# Altium project vme6U_carrier_Cyc_V_SoC.PrjPcb (part 5 of 8)

## Sheet RFCtl.SchDoc
size 420 x 297 mm; Address1: Address1; Address2: Address2; Address3: Address3; Address4: Address4; SheetNumber: 1; Scale: 1:1; Разраб.: Иванов; Обозначение документа: АБВГ.123456.001 Э3; Пров.: Петров; Утв.: Сидоров; Наименование организации: ОАО "Концерн "МПО-Гидроприбор"; Перв. применение: АБВГ.123456.000; Наименование изделия 1: Плата; Наименование изделия 2: Схема электрическая; Наименование изделия 3: принципиальная; Нач. отд.: Нач. отд.; Фамилия нач. отд.: Сидоров
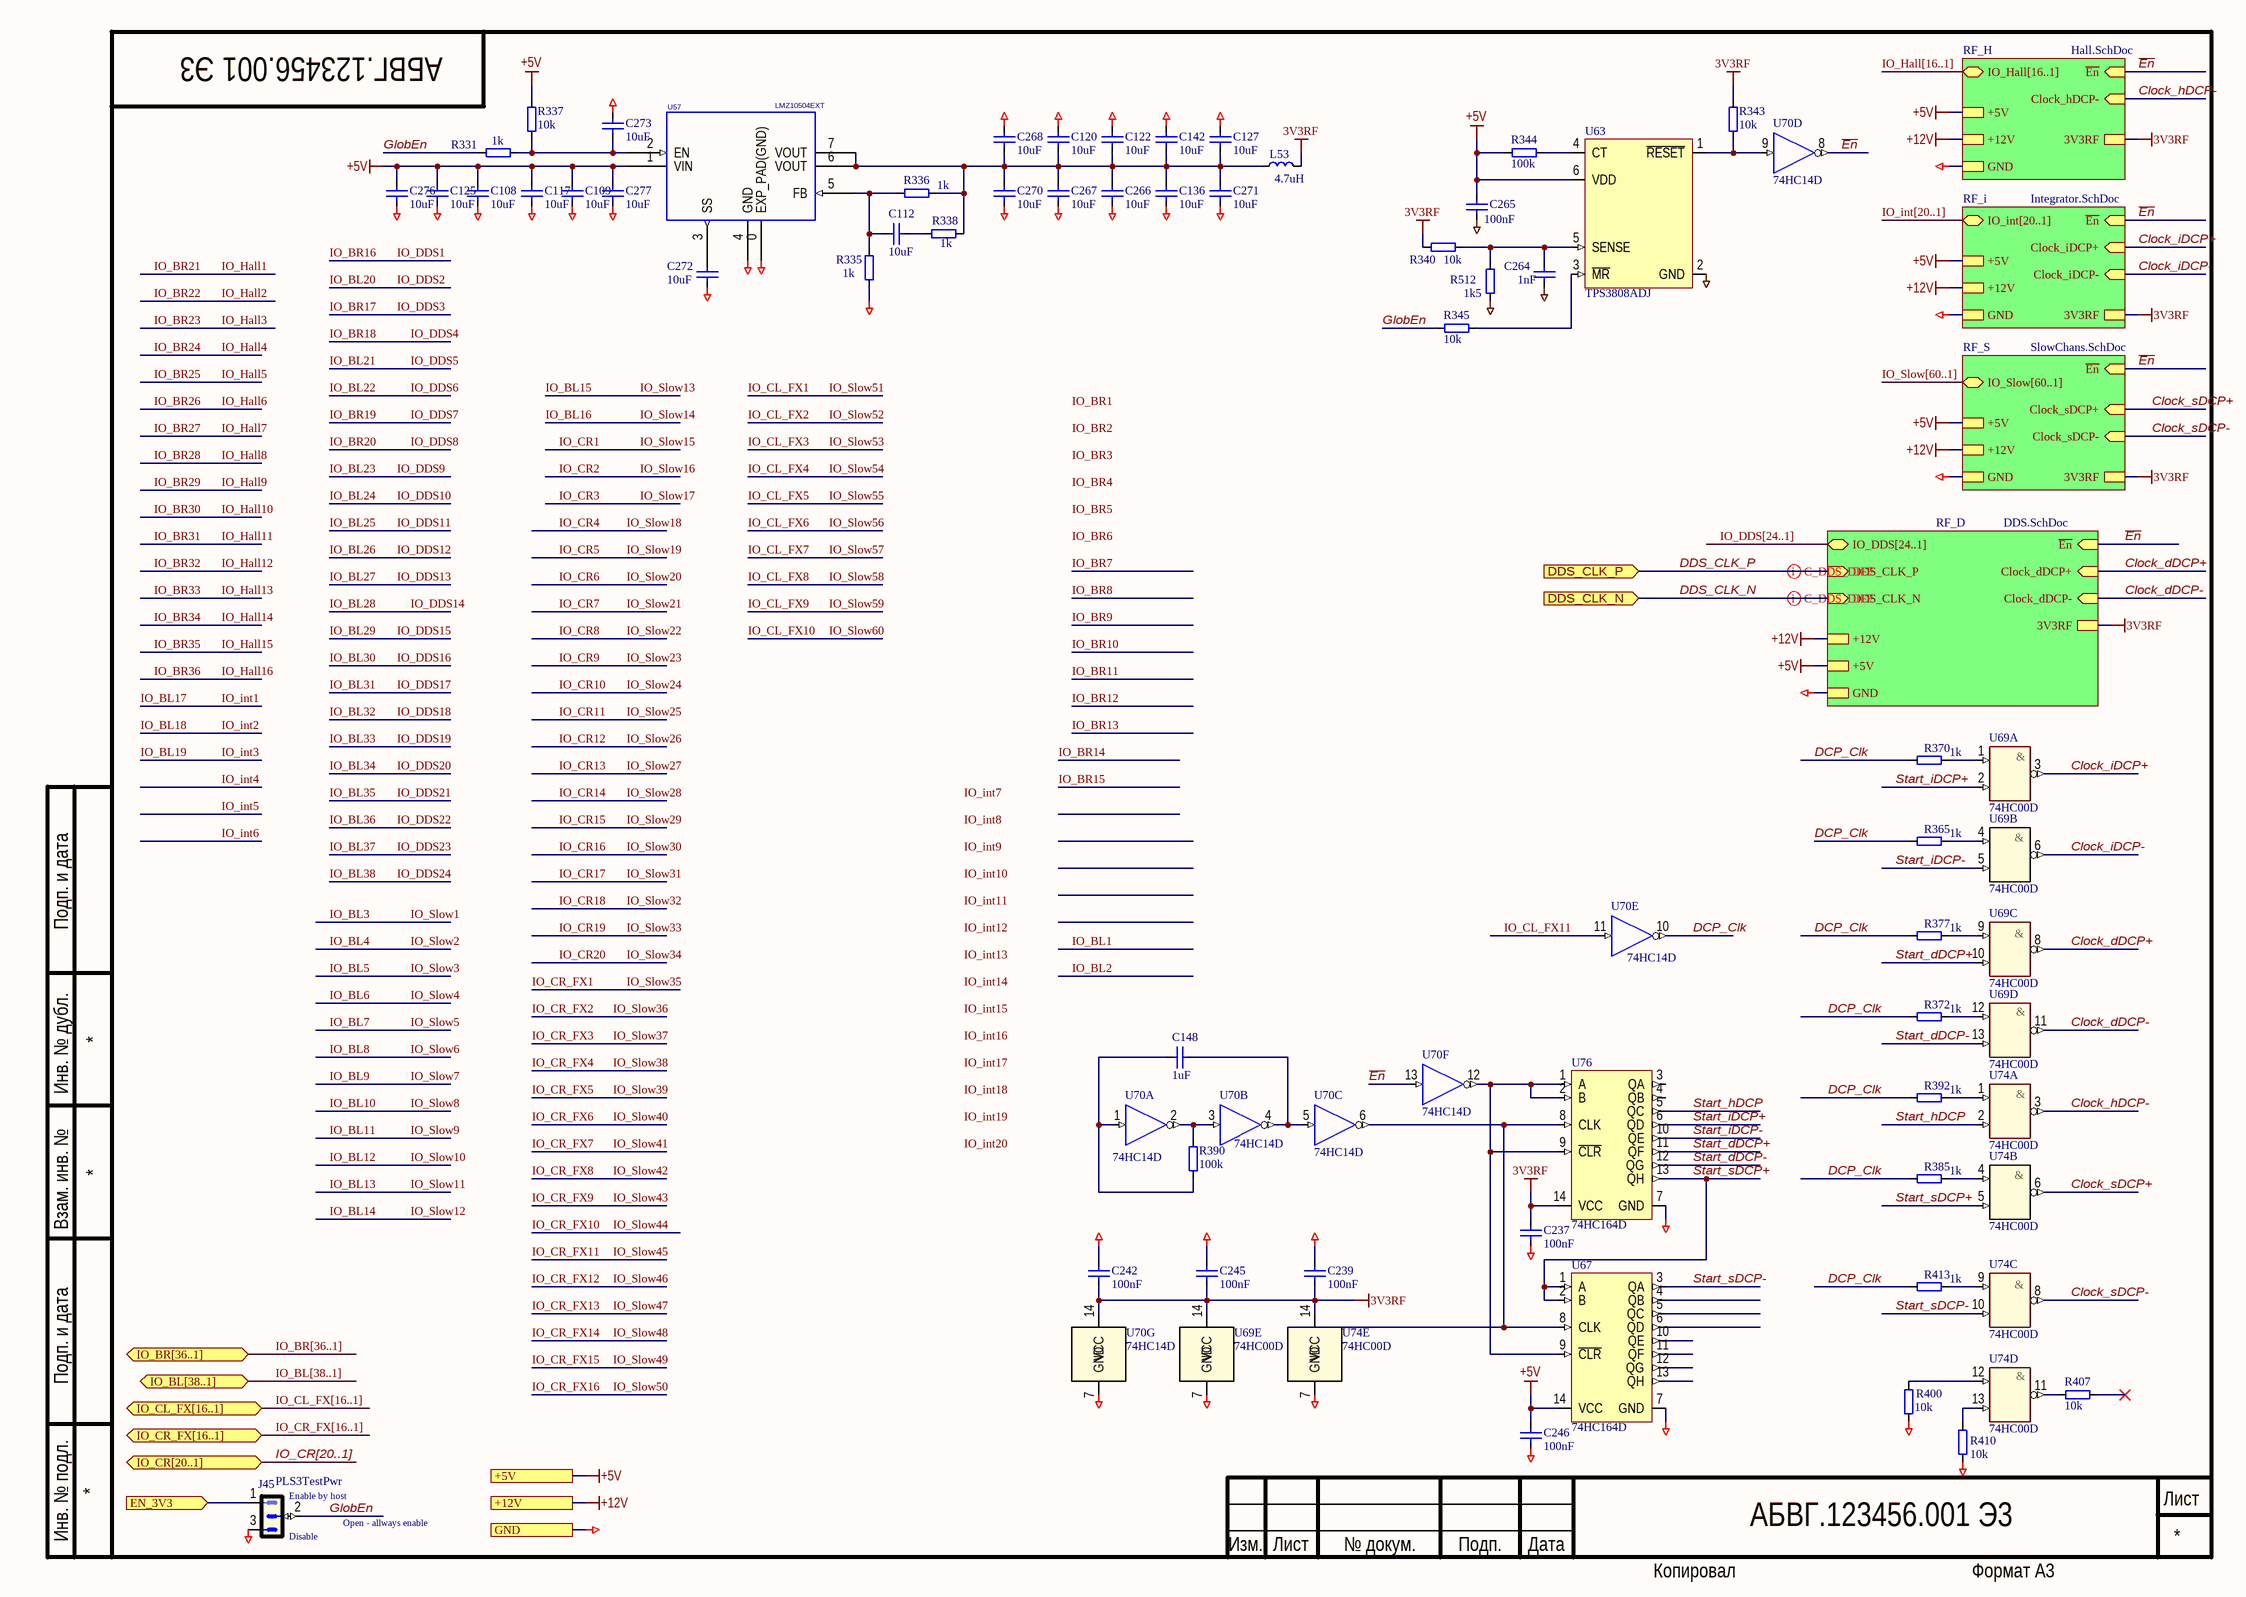
[diagram p15: RFCtl.SchDoc]

### Parts
(Parts that share a designator on the sheet are numbered #1, #2 ... from top to bottom, then left to right.)
C108  10uF  [SMD0805CAP]
C109  10uF  [SMD0805CAP]
C112#2  10uF  [SMD0805CAP]
C117#2  10uF  [SMD0805CAP]
C120#2  10uF  [SMD0805CAP]
C122#2  10uF  [SMD0805CAP]
C125#2  10uF  [SMD0805CAP]
C127#2  10uF  [SMD0805CAP]
C136  10uF  [SMD0805CAP]
C142#2  10uF  [SMD0805CAP]
C148#2  1uF  [SMD0805CAP]
C237  100nF  [SMD0805CAP]
C239  100nF  [SMD0805CAP]
C242  100nF  [SMD0805CAP]
C245  100nF  [SMD0805CAP]
C246  100nF  [SMD0805CAP]
C264  1nF  [SMD0805CAP]
C265  100nF  [SMD0805CAP]
C266  10uF  [SMD0805CAP]
C267  10uF  [SMD0805CAP]
C268  10uF  [SMD0805CAP]
C270  10uF  [SMD0805CAP]
C271  10uF  [SMD0805CAP]
C272  10uF  [SMD0805CAP]
C273  10uF  [SMD0805CAP]
C276  10uF  [SMD0805CAP]
C277  10uF  [SMD0805CAP]
J45  PLS3TestPwr  [PLS3]
L53  value 4.7uH  [IND_3225_MURATA_LQH_N]  (hidden comment: LQH32PN4R7NN0L)
R331  1k  [SMD0805RES]
R335  1k  [SMD0805RES]
R336  1k  [SMD0805RES]
R337  10k  [SMD0805RES]
R338  1k  [SMD0805RES]
R340  10k  [SMD0805RES]
R343  10k  [SMD0805RES]
R344  100k  [SMD0805RES]
R345  10k  [SMD0805RES]
R365  1k  [SMD0805RES]
R370  1k  [SMD0805RES]
R372  1k  [SMD0805RES]
R377  1k  [SMD0805RES]
R385  1k  [SMD0805RES]
R390  100k  [SMD0805RES]
R392  1k  [SMD0805RES]
R400  10k  [SMD0805RES]
R407  10k  [SMD0805RES]
R410  10k  [SMD0805RES]
R413  1k  [SMD0805RES]
R512  1k5  [SMD0805RES]
U57  LMZ10504EXT  [TO-PMOD7]
U63  TPS3808ADJ  [SOT95P270X145-6N]
U67  74HC164D  [SOIC127P600X175-14N]
U69  74HC00D  [SOIC127P600X175-14N]  (parts A,B,C,D,E of 5)
U70  74HC14D  [SOIC127P600X175-14N]  (parts A,B,C,D,E,F,G of 7)
U74  74HC00D  [SOIC127P600X175-14N]  (parts A,B,C,D,E of 5)
U76  74HC164D  [SOIC127P600X175-14N]

### Sub-sheets
RF_D = DDS.SchDoc: IO_DDS[24..1] (bidir), ~{En} (in), Clock_dDCP- (in), Clock_dDCP+ (in), DDS_CLK_N (in), DDS_CLK_P (in), GND, +5V, 3V3RF, +12V
RF_H = Hall.SchDoc: IO_Hall[16..1] (bidir), ~{En} (in), Clock_hDCP- (in), GND, +12V, +5V, 3V3RF
RF_i = Integrator.SchDoc: IO_int[20..1] (bidir), ~{En} (in), Clock_iDCP- (in), Clock_iDCP+ (in), GND, +12V, +5V, 3V3RF
RF_S = SlowChans.SchDoc: IO_Slow[60..1] (bidir), ~{En} (in), Clock_sDCP- (in), Clock_sDCP+ (in), +5V, +12V, GND, 3V3RF

### Ports
+5V, +12V, DDS_CLK_N (in), DDS_CLK_P (in), EN_3V3 (in), GND, IO_BL[38..1] (bidir), IO_BR[36..1] (bidir), IO_CL_FX[16..1] (bidir), IO_CR[20..1] (bidir), IO_CR_FX[16..1] (bidir)

### Nets
3V3RF: C237.2 C239.1 C242.1 C245.1 L53.2 R340.1 R343.1 U69.14(VCC) U70.14(VCC) U74.14(VCC) U76.14(VCC) ; sheet RF_H/3V3RF, sheet RF_i/3V3RF, sheet RF_D/3V3RF, sheet RF_S/3V3RF
+5V: C108.2 C109.2 C117#2.2 C125#2.2 C246.2 C265.2 C276.2 C277.2 R337.2 R344.1 U57.1(VIN) U63.6(VDD) U67.14(VCC) ; port +5V, sheet RF_H/+5V, sheet RF_i/+5V, sheet RF_D/+5V, sheet RF_S/+5V  [project net +5VME]
+12V: port +12V, sheet RF_H/+12V, sheet RF_i/+12V, sheet RF_D/+12V, sheet RF_S/+12V  [project net +12Vin]
GND: C108.1 C109.1 C117#2.1 C120#2.2 C122#2.2 C125#2.1 C127#2.1 C136.1 C142#2.2 C237.1 C239.2 C242.2 C245.2 C246.1 C264.1 C265.1 C266.1 C267.1 C268.2 C270.1 C271.1 C272.1 C273.2 C276.1 C277.1 J45.3 R335.1 R400.1 R410.1 R512.1 U57.0(EXP_PAD(GND)) U57.4(GND) U63.2(GND) U67.7(GND) U69.7(GND) U70.7(GND) U74.7(GND) U76.7(GND) ; port GND, sheet RF_H/GND, sheet RF_i/GND, sheet RF_D/GND, sheet RF_S/GND  [project net POK_int]
~{En}: U70.8(OUT) U70.13(IN) ; sheet RF_H/~{En}, sheet RF_i/~{En}, sheet RF_D/~{En}, sheet RF_S/~{En}
Clock_dDCP+: U69.8(OUT) ; sheet RF_D/Clock_dDCP+
Clock_dDCP-: U69.11(OUT) ; sheet RF_D/Clock_dDCP-
Clock_hDCP-: U74.3(OUT) ; sheet RF_H/Clock_hDCP-
Clock_iDCP+: U69.3(OUT) ; sheet RF_i/Clock_iDCP+
Clock_iDCP-: U69.6(OUT) ; sheet RF_i/Clock_iDCP-
Clock_sDCP+: U74.6(OUT) ; sheet RF_S/Clock_sDCP+
Clock_sDCP-: U74.8(OUT) ; sheet RF_S/Clock_sDCP-
DCP_Clk: R365.2 R370.2 R372.2 R377.2 R385.2 R392.2 R413.2 U70.10(OUT)
DDS_CLK_N: port DDS_CLK_N, sheet RF_D/DDS_CLK_N
DDS_CLK_P: port DDS_CLK_P, sheet RF_D/DDS_CLK_P
EN_3V3: J45.1 ; port EN_3V3
GlobEn: J45.2 R331.2 R345.2
IO_CL_FX11: U70.11(IN)
Start_dDCP+: U69.10(IN) U76.11(QF)
Start_dDCP-: U69.13(IN) U76.12(QG)
Start_hDCP: U74.2(IN) U76.5(QC)
Start_iDCP+: U69.2(IN) U76.6(QD)
Start_iDCP-: U69.5(IN) U76.10(QE)
Start_sDCP+: U67.1(A) U67.2(B) U74.5(IN) U76.13(QH)
Start_sDCP-: U67.3(QA) U74.10(IN)
NetC112#2_1: C112#2.1 R335.2 R336.1 U57.5(FB)
NetC112#2_2: C112#2.2 R338.2
NetC120#2_1: C120#2.1 C122#2.1 C127#2.2 C136.2 C142#2.1 C266.2 C267.2 C268.1 C270.2 C271.2 L53.1 R336.2 R338.1 U57.6(VOUT) U57.7(VOUT)
NetC148#2_1: C148#2.1 U70.4(OUT) U70.5(IN)
NetC148#2_2: C148#2.2 R390.1 U70.1(IN)
NetC264_2: C264.2 R340.2 R512.2 U63.5(SENSE)
NetC272_2: C272.2 U57.3(SS)
NetC273_1: C273.1 R331.1 R337.1 U57.2(EN)
NetR343_2: R343.2 U63.1(~{RESET}) U70.9(IN)
NetR344_2: R344.2 U63.4(CT)
NetR345_1: R345.1 U63.3(~{MR})
NetR365_1: R365.1 U69.4(IN)
NetR370_1: R370.1 U69.1(IN)
NetR372_1: R372.1 U69.12(IN)
NetR377_1: R377.1 U69.9(IN)
NetR385_1: R385.1 U74.4(IN)
NetR390_2: R390.2 U70.2(OUT) U70.3(IN)
NetR392_1: R392.1 U74.1(IN)
NetR400_2: R400.2 U74.12(IN)
NetR407_2: R407.2 U74.11(OUT)
NetR410_2: R410.2 U74.13(IN)
NetR413_1: R413.1 U74.9(IN)
NetU67_8: U67.8(CLK) U70.6(OUT) U76.8(CLK)
NetU67_9: U67.9(~{CLR}) U70.12(OUT) U76.1(A) U76.2(B) U76.9(~{CLR})

Not connected (* = marked no-connect by the designer): R407 1*; U67 4(QB) 5(QC) 6(QD) 10(QE) 11(QF) 12(QG) 13(QH); U76 3(QA) 4(QB)

### Buses and harness runs
bus IO_BL[38..1] = port IO_BL[38..1]
bus IO_BR[36..1] = port IO_BR[36..1]
bus IO_CL_FX[16..1] = port IO_CL_FX[16..1]
bus IO_CR[20..1] = port IO_CR[20..1]
bus IO_CR_FX[16..1] = port IO_CR_FX[16..1]
bus IO_DDS[24..1] = sheet RF_D/IO_DDS[24..1]
bus IO_Hall[16..1] = sheet RF_H/IO_Hall[16..1]
bus IO_int[20..1] = sheet RF_i/IO_int[20..1]
bus IO_Slow[60..1] = sheet RF_S/IO_Slow[60..1]

### Layout directives
differential pair; rule Differential Pairs Routing [Pref Gap = 0.175mm    Min Gap  = 0.075mm    Max Gap  = 0.5mmPref Width = 0.25mm    Min Width  = 0.075mm    Max Width  = 0.5mm]: DDS_CLK_N, DDS_CLK_P

### Notes on the sheet
- (near J45) Disable
- (near J45) Enable by host
- Open - allways enable
- Labels drawn without touching a wire or pin: IO_BR1, IO_BR2, IO_BR3, IO_BR4, IO_BR5, IO_BR6, IO_int7, IO_int8, IO_int9, IO_int10, IO_int11, IO_int12, IO_int13, IO_int14, IO_int15, IO_int16, IO_int17, IO_int18, IO_int19, IO_int20
- Подп. и дата
- Инв. № дубл.
- Взам. инв. №
- Инв. № подл.
- Изм.
- Лист
- № докум.
- Подп.
- Дата
- Копировал
- Формат А3
- (in symbol 74HC00D, part A) &
- (in symbol 74HC00D, part B) &
- (in symbol 74HC00D, part C) &
- (in symbol 74HC00D, part D) &

### Library data of the parts
C108 C109 C117#2 C120#2 C122#2 C125#2 C127#2 C136 C142#2 C266-C268 C270-C273 C276 C277 = C0805: Чип конденсатор 0805; Pkg: SMD0805; Vendor: Vishay; SMD Solders: 2; Tolerance: 20%; Voltage: 25V; DielectricType: X5R; Solder Option: RM; Device: Cap0805; Value: 10uF; Price: 2
C112#2 C148#2 C237 C239 C242 C245 C246 C264 C265 = C0805: Чип конденсатор 0805; Voltage: 25V; Vendor: Vishay; DielectricType: X5R; SMD Solders: 2; Solder Option: RM; Tolerance: 20%; Pkg: SMD0805; Device: Cap0805; Price: 2
  C112#2: Value: 10uF
  C148#2: Value: 1uF
  C237 C239 C242 C245 C246 C265: Value: 100nF
  C264: Value: 1nF
J45 = PLS3: Vendor: Confly; SMD Solders: 0; Solder Option: RM; THD Solders: 3; Price: 1; Value: TestPwr; Device: PLS3
L53 = LQH32PN4R7NN0L: Inductor, Fixed, 1210, 4.7uH, 216mOhm, 1A, 30%; Pkg: 1210; Vendor: Murata; Maintainer: Evgeniy Kotov; SMD Solders: 2; THD Solders: 0; DC Current: 750mA; Tolerance: 20%; DC Resistance: 380mΩ; PartField: LQH32PN4R7NN0L; Release Date: 30.03.2017; Last Change Data: 30.03.2017; Temperature Range: -40°C to +105°C
R331 R338 R365 R370 R372 R377 R385 R392 R413 = R0805: Чип резистор 0805; Pkg: SMD0805; Vendor: Vishay; SMD Solders: 2; Tolerance: 1%; Solder Option: RM; TC: 100ppm/C; Pwr: 125mW; Device: Res0805; Value: 1k; Price: 2
R335-R337 R340 R343 R345 R390 R400 R407 R410 R512 = R0805: Чип резистор 0805; Vendor: Vishay; SMD Solders: 2; Solder Option: RM; TC: 100ppm/C; Tolerance: 1%; Pkg: SMD0805; Pwr: 125mW; Device: Res0805; Price: 2
  R335 R336: Value: 1k
  R337 R340 R343 R345 R400 R407 R410: Value: 10k
  R390: Value: 100k
  R512: Value: 1k5
R344 = R0805: Чип резистор 0805; Vendor: Vishay; SMD Solders: 2; Solder Option: Dbg; TC: 100ppm/C; Tolerance: 1%; Pkg: SMD0805; Pwr: 125mW; Device: Res0805; Price: 2; Value: 100k
U57 = LMZ10504EXT_NDW: 4A, SIMPLE SWITCHER® Power Module with 5.5V Maximum Input Voltage for Military and Rugged Applications; Manufacturer: Texas Instruments; Manufacturer_Part_Number: lmz10504ext_ndw_7; NSC_PackageReference: TZA07A; Pkg: PMOD-7EP; SMD Solders: 8; THD Solders: 0; Value: LMZ10504EXT; HelpURL: http://www.ti.com/lit/ds/symlink/lmz10504ext.pdf; basePN: LMZ10504EXT; Vendor: Texas Instruments; PartField: LMZ10504EXT
U63 = TPS3808: Supervisory Circuit. Low-Quiescent-Current, Programmable-Delay; Vendor: Texas Instruments; Value: ADJ; Pkg: SOT23-6; SMD Solders: 6; Solder Option: RM; THD Solders: 0; Name to order: TPS3808G01DBV; Current: 6uA; thVoltage: 400mV; Price: 200; Device: TPS3808
U67 U76 = 74HC164D: Сдвиговый регистр. Посл. вх. 8 разр. выход.; Pkg: SOIC14; SMD Solders: 14; Solder Option: RM; THD Solders: 0; Vendor: NXP; Voltage: 2V0.. 6V0; Device: 74HC164D; Price: 30; Name to order: 74HC164D
U69 U74 = 74HC00D: 4 лог. элемента 2И-НЕ; Vendor: NXP; Pkg: SOIC14; SMD Solders: 14; Solder Option: RM; Voltage: 2.. 6V; Price: 50; Device: 74HC00D; Name to order: 74HC00D
U70 = 74HC14D: 6 триггеров Шмита с инверсией.; Vendor: NXP; Pkg: SOIC14; SMD Solders: 14; Solder Option: RM; Voltage: 2.. 6V; Price: 50; Device: 74HC14D; Name to order: 74HC14D

## Sheet Hall.SchDoc
size 594 x 420 mm; Address1: Address1; Address2: Address2; Address3: Address3; Address4: Address4; SheetNumber: 1; Scale: 1:1; Разраб.: Иванов; Обозначение документа: АБВГ.123456.001 Э3; Пров.: Петров; Утв.: Сидоров; Наименование организации: ОАО "Концерн "МПО-Гидроприбор"; Перв. применение: АБВГ.123456.000; Наименование изделия 1: Плата; Наименование изделия 2: Схема электрическая; Наименование изделия 3: принципиальная; Нач. отд.: Нач. отд.; Фамилия нач. отд.: Сидоров
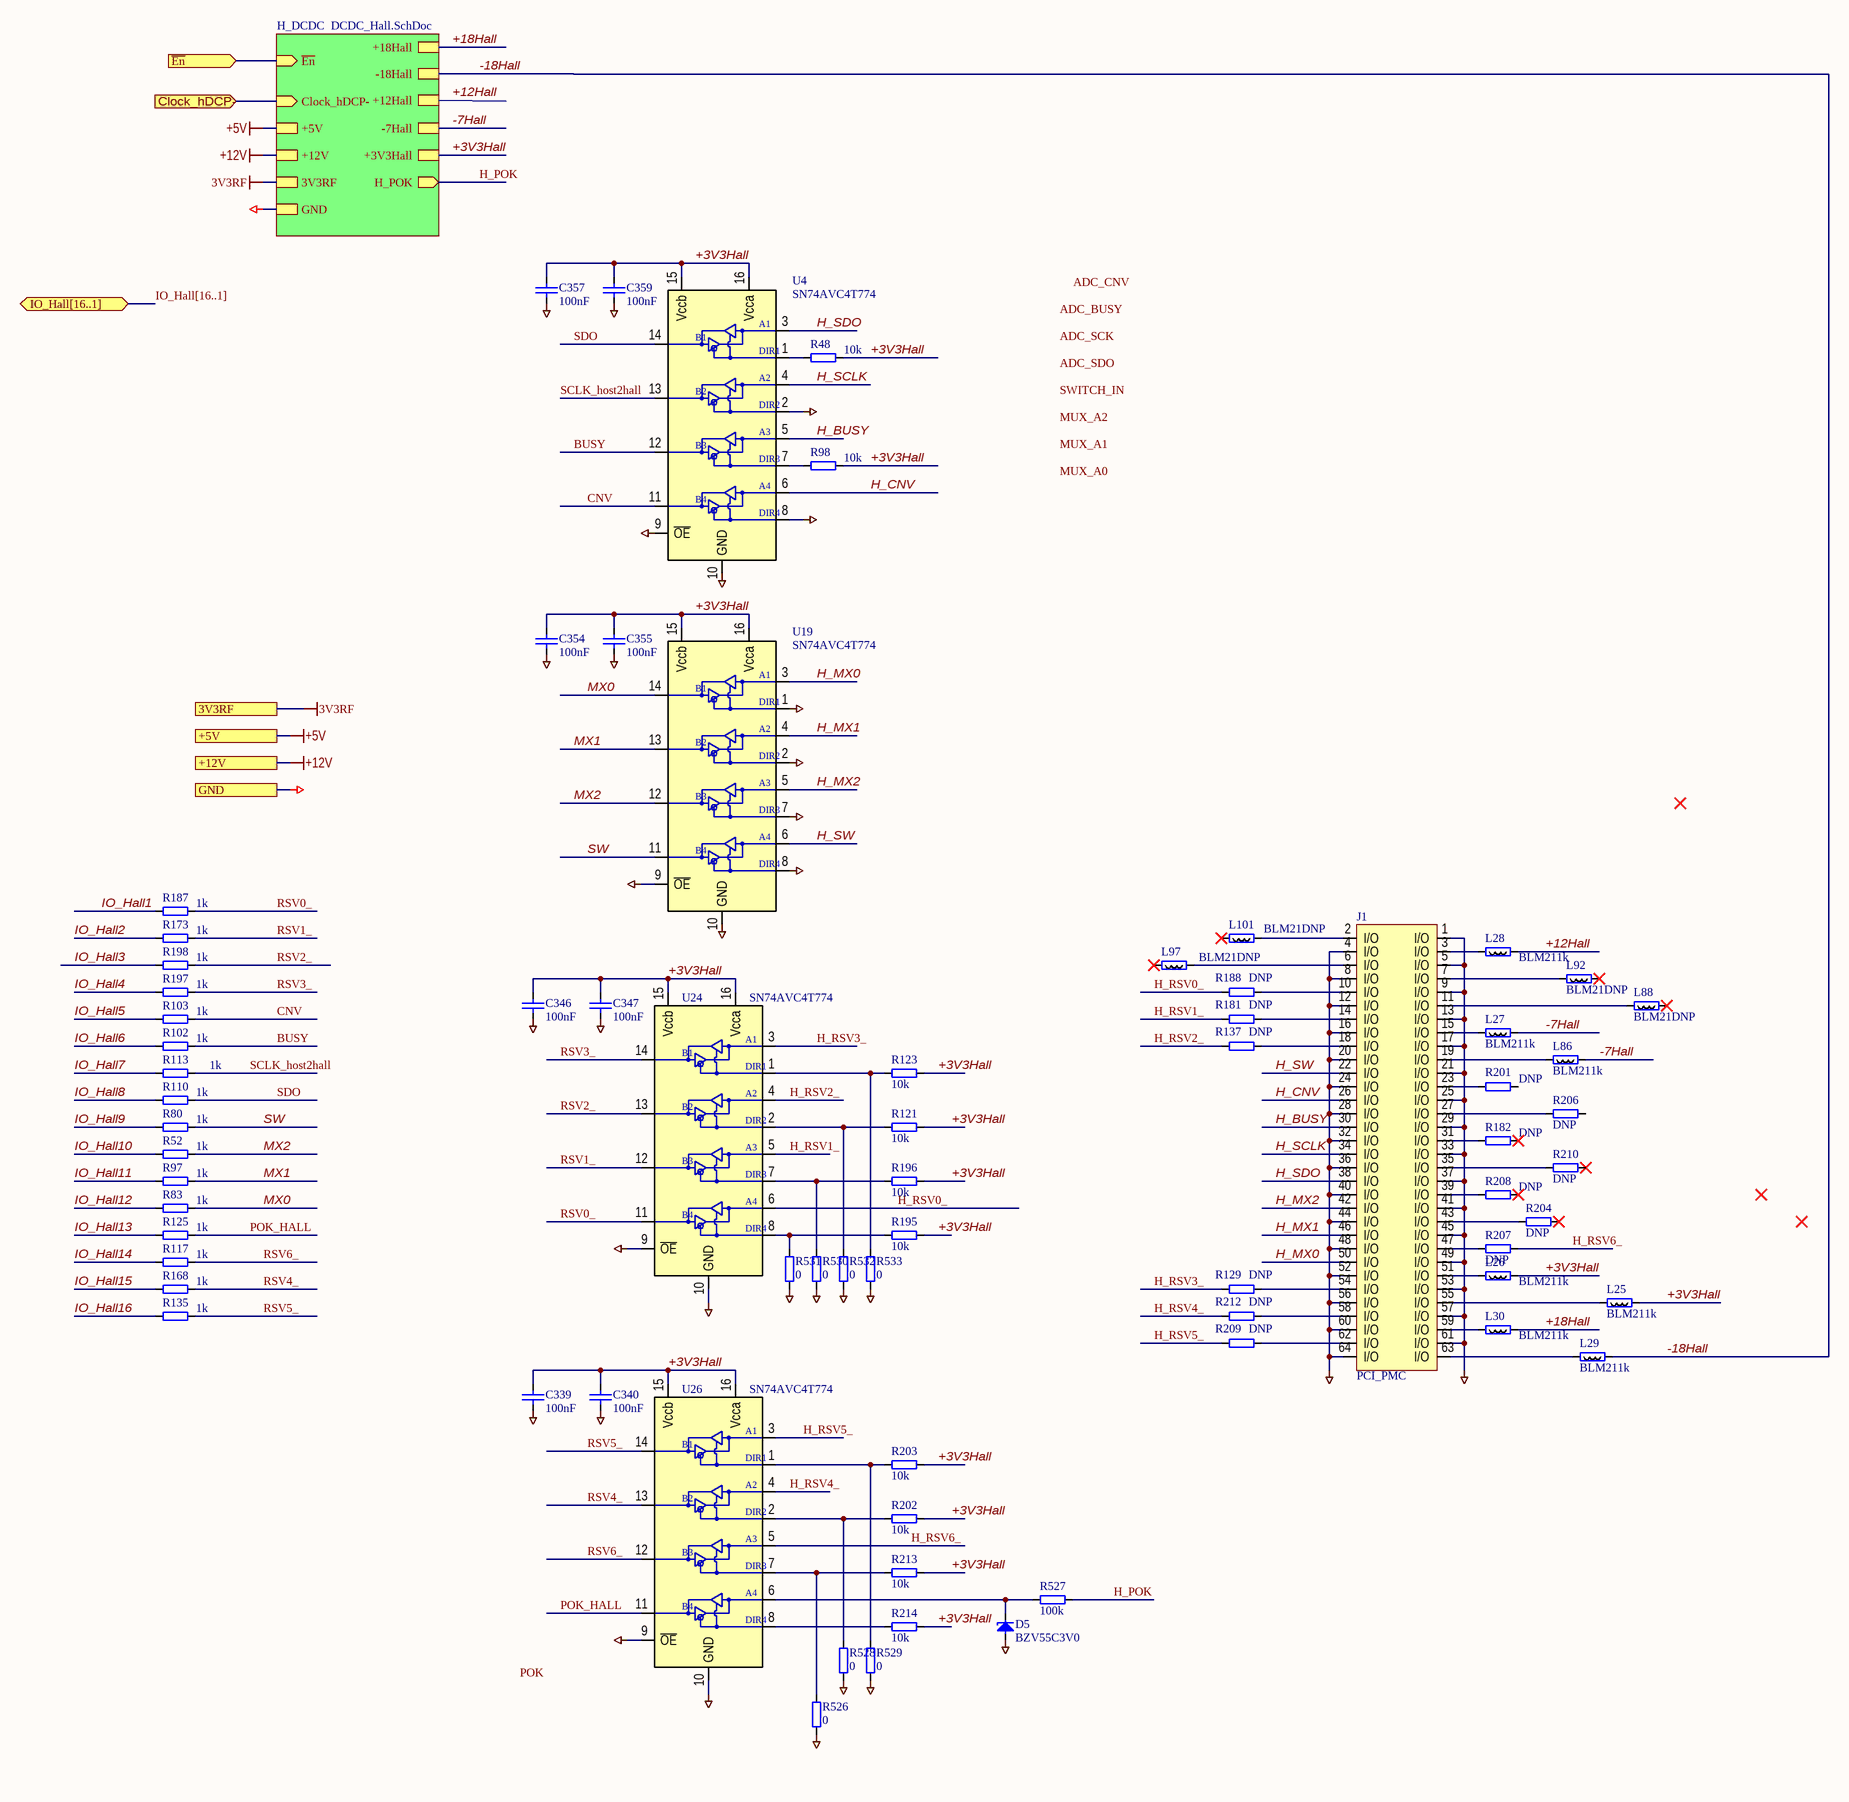
[diagram p16: Hall.SchDoc]

### Parts
(Parts that share a designator on the sheet are numbered #1, #2 ... from top to bottom, then left to right.)
C339  100nF  [SMD0805CAP]
C340  100nF  [SMD0805CAP]
C346  100nF  [SMD0805CAP]
C347  100nF  [SMD0805CAP]
C354  100nF  [SMD0805CAP]
C355  100nF  [SMD0805CAP]
C357  100nF  [SMD0805CAP]
C359  100nF  [SMD0805CAP]
D5  BZV55C3V0  [DIOMELF3516N]
J1#2  PCI_PMC  [TYCO_120521-1]
L25  BLM211k  [RESC2012X50N]
L26  BLM211k  [RESC2012X50N]
L27  BLM211k  [RESC2012X50N]
L28  BLM211k  [RESC2012X50N]
L29  BLM211k  [RESC2012X50N]
L30  BLM211k  [RESC2012X50N]
L86  BLM211k  [RESC2012X50N]
L88  BLM21DNP  [RESC2012X50N]
L92  BLM21DNP  [RESC2012X50N]
L97  BLM21DNP  [RESC2012X50N]
L101  BLM21DNP  [RESC2012X50N]
R48  10k  [SMD0805RES]
R52  1k  [SMD0805RES]
R80#2  1k  [SMD0805RES]
R83#2  1k  [SMD0805RES]
R97#2  1k  [SMD0805RES]
R98#2  10k  [SMD0805RES]
R102  1k  [SMD0805RES]
R103#2  1k  [SMD0805RES]
R110#2  1k  [SMD0805RES]
R113#2  1k  [SMD0805RES]
R117#2  1k  [SMD0805RES]
R121  10k  [SMD0805RES]
R123#2  10k  [SMD0805RES]
R125#2  1k  [SMD0805RES]
R129#2  DNP  [SMD0805RES]
R135#2  1k  [SMD0805RES]
R137#2  DNP  [SMD0805RES]
R168#2  1k  [SMD0805RES]
R173#2  1k  [SMD0805RES]
R181#2  DNP  [SMD0805RES]
R182#2  DNP  [SMD0805RES]
R187  1k  [SMD0805RES]
R188  DNP  [SMD0805RES]
R195  10k  [SMD0805RES]
R196  10k  [SMD0805RES]
R197  1k  [SMD0805RES]
R198  1k  [SMD0805RES]
R201  DNP  [SMD0805RES]
R202  10k  [SMD0805RES]
R203  10k  [SMD0805RES]
R204  DNP  [SMD0805RES]
R206  DNP  [SMD0805RES]
R207  DNP  [SMD0805RES]
R208  DNP  [SMD0805RES]
R209  DNP  [SMD0805RES]
R210  DNP  [SMD0805RES]
R212  DNP  [SMD0805RES]
R213  10k  [SMD0805RES]
R214  10k  [SMD0805RES]
R526  0  [SMD0805RES]
R527  100k  [SMD0805RES]
R528  0  [SMD0805RES]
R529  0  [SMD0805RES]
R530  0  [SMD0805RES]
R531  0  [SMD0805RES]
R532  0  [SMD0805RES]
R533  0  [SMD0805RES]
U4  SN74AVC4T774  [TSSOP-16]
U19#2  SN74AVC4T774  [TSSOP-16]
U24#2  SN74AVC4T774  [TSSOP-16]
U26#2  SN74AVC4T774  [TSSOP-16]

### Sub-sheets
H_DCDC = DCDC_Hall.SchDoc: +18Hall, -18Hall, +12Hall, -7Hall, +3V3Hall, ~{En} (in), Clock_hDCP- (in), GND, +12V, +5V, 3V3RF, H_POK (out)

### Ports
3V3RF, +5V, +12V, Clock_hDCP- (in), GND, IO_Hall[16..1] (bidir), ~{En} (in)

### Nets
3V3RF: port 3V3RF, sheet H_DCDC/3V3RF
+5V: port +5V, sheet H_DCDC/+5V  [project net +5VME]
+12V: port +12V, sheet H_DCDC/+12V  [project net +12Vin]
GND: C339.1 C340.1 C346.1 C347.1 C354.1 C355.1 C357.1 C359.1 D5.2(A) J1#2.1(I/O) J1#2.4(I/O) J1#2.5(I/O) J1#2.8(I/O) J1#2.9(I/O) J1#2.12(I/O) J1#2.13(I/O) J1#2.16(I/O) J1#2.17(I/O) J1#2.20(I/O) J1#2.21(I/O) J1#2.24(I/O) J1#2.25(I/O) J1#2.28(I/O) J1#2.29(I/O) J1#2.32(I/O) J1#2.33(I/O) J1#2.36(I/O) J1#2.37(I/O) J1#2.40(I/O) J1#2.41(I/O) J1#2.44(I/O) J1#2.45(I/O) J1#2.48(I/O) J1#2.49(I/O) J1#2.52(I/O) J1#2.53(I/O) J1#2.56(I/O) J1#2.57(I/O) J1#2.60(I/O) J1#2.61(I/O) J1#2.64(I/O) R526.1 R528.1 R529.1 R530.1 R531.1 R532.1 R533.1 U4.2(DIR2) U4.8(DIR4) U4.9(~{OE}) U4.10(GND) U19#2.1(DIR1) U19#2.2(DIR2) U19#2.7(DIR3) U19#2.8(DIR4) U19#2.9(~{OE}) U19#2.10(GND) U24#2.9(~{OE}) U24#2.10(GND) U26#2.9(~{OE}) U26#2.10(GND) ; port GND, sheet H_DCDC/GND  [project net POK_int]
+3V3Hall: C339.2 C340.2 C346.2 C347.2 C354.2 C355.2 C357.2 C359.2 L25.2 L26.2 R48.1 R98#2.1 R121.2 R123#2.2 R195.2 R196.2 R202.2 R203.2 R213.2 R214.2 U4.15(Vccb) U4.16(Vcca) U19#2.15(Vccb) U19#2.16(Vcca) U24#2.15(Vccb) U24#2.16(Vcca) U26#2.15(Vccb) U26#2.16(Vcca) ; sheet H_DCDC/+3V3Hall
+12Hall: L28.2 ; sheet H_DCDC/+12Hall
+18Hall: L30.2 ; sheet H_DCDC/+18Hall
-7Hall: L27.2 L86.2 ; sheet H_DCDC/-7Hall
-18Hall: L29.2 ; sheet H_DCDC/-18Hall
~{En}: port ~{En}, sheet H_DCDC/~{En}
BUSY: R102.1 U4.12(B3)
Clock_hDCP-: port Clock_hDCP-, sheet H_DCDC/Clock_hDCP-
CNV: R103#2.1 U4.11(B4)
H_BUSY: J1#2.30(I/O) U4.5(A3)
H_CNV: J1#2.26(I/O) U4.6(A4)
H_MX0: J1#2.50(I/O) U19#2.3(A1)
H_MX1: J1#2.46(I/O) U19#2.4(A2)
H_MX2: J1#2.42(I/O) U19#2.5(A3)
H_POK: R527.1 ; sheet H_DCDC/H_POK
H_RSV0_: R188.2 U24#2.6(A4)
H_RSV1_: R181#2.2 U24#2.5(A3)
H_RSV2_: R137#2.2 U24#2.4(A2)
H_RSV3_: R129#2.2 U24#2.3(A1)
H_RSV4_: R212.2 U26#2.4(A2)
H_RSV5_: R209.2 U26#2.3(A1)
H_RSV6_: R207.2 U26#2.5(A3)
H_SCLK: J1#2.34(I/O) U4.4(A2)
H_SDO: J1#2.38(I/O) U4.3(A1)
H_SW: J1#2.22(I/O) U19#2.6(A4)
IO_Hall1: R187.2  [project net IO_BR21]
IO_Hall2: R173#2.2  [project net IO_BR22]
IO_Hall3: R198.2  [project net IO_BR23]
IO_Hall4: R197.2  [project net IO_BR24]
IO_Hall5: R103#2.2  [project net IO_BR25]
IO_Hall6: R102.2  [project net IO_BR26]
IO_Hall7: R113#2.2  [project net IO_BR27]
IO_Hall8: R110#2.2  [project net IO_BR28]
IO_Hall9: R80#2.2  [project net IO_BR29]
IO_Hall10: R52.2  [project net IO_BR30]
IO_Hall11: R97#2.2  [project net IO_BR31]
IO_Hall12: R83#2.2  [project net IO_BR32]
IO_Hall13: R125#2.2  [project net IO_BR33]
IO_Hall14: R117#2.2  [project net IO_BR34]
IO_Hall15: R168#2.2  [project net IO_BR35]
IO_Hall16: R135#2.2  [project net IO_BR36]
MX0: R83#2.1 U19#2.14(B1)
MX1: R97#2.1 U19#2.13(B2)
MX2: R52.1 U19#2.12(B3)
POK_HALL: R125#2.1 U26#2.11(B4)
RSV0_: R187.1 U24#2.11(B4)
RSV1_: R173#2.1 U24#2.12(B3)
RSV2_: R198.1 U24#2.13(B2)
RSV3_: R197.1 U24#2.14(B1)
RSV4_: R168#2.1 U26#2.13(B2)
RSV5_: R135#2.1 U26#2.14(B1)
RSV6_: R117#2.1 U26#2.12(B3)
SCLK_host2hall: R113#2.1 U4.13(B2)
SDO: R110#2.1 U4.14(B1)
SW: R80#2.1 U19#2.11(B4)
NetD5_1: D5.1(C) R527.2 U26#2.6(A4)
NetJ1#2_2: J1#2.2(I/O) L101.2
NetJ1#2_3: J1#2.3(I/O) L28.1
NetJ1#2_6: J1#2.6(I/O) L97.2
NetJ1#2_7: J1#2.7(I/O) L92.1
NetJ1#2_10: J1#2.10(I/O) R188.1
NetJ1#2_11: J1#2.11(I/O) L88.1
NetJ1#2_14: J1#2.14(I/O) R181#2.1
NetJ1#2_15: J1#2.15(I/O) L27.1
NetJ1#2_18: J1#2.18(I/O) R137#2.1
NetJ1#2_19: J1#2.19(I/O) L86.1
NetJ1#2_23: J1#2.23(I/O) R201.2
NetJ1#2_27: J1#2.27(I/O) R206.1
NetJ1#2_31: J1#2.31(I/O) R182#2.2
NetJ1#2_35: J1#2.35(I/O) R210.1
NetJ1#2_39: J1#2.39(I/O) R208.2
NetJ1#2_43: J1#2.43(I/O) R204.1
NetJ1#2_47: J1#2.47(I/O) R207.1
NetJ1#2_51: J1#2.51(I/O) L26.1
NetJ1#2_54: J1#2.54(I/O) R129#2.1
NetJ1#2_55: J1#2.55(I/O) L25.1
NetJ1#2_58: J1#2.58(I/O) R212.1
NetJ1#2_59: J1#2.59(I/O) L30.1
NetJ1#2_62: J1#2.62(I/O) R209.1
NetJ1#2_63: J1#2.63(I/O) L29.1
NetR48_2: R48.2 U4.1(DIR1)
NetR98#2_2: R98#2.2 U4.7(DIR3)
NetR121_1: R121.1 R532.2 U24#2.2(DIR2)
NetR123#2_1: R123#2.1 R533.2 U24#2.1(DIR1)
NetR195_1: R195.1 R531.2 U24#2.8(DIR4)
NetR196_1: R196.1 R530.2 U24#2.7(DIR3)
NetR202_1: R202.1 R528.2 U26#2.2(DIR2)
NetR203_1: R203.1 R529.2 U26#2.1(DIR1)
NetR213_1: R213.1 R526.2 U26#2.7(DIR3)
NetR214_1: R214.1 U26#2.8(DIR4)

Not connected (* = marked no-connect by the designer): L88 2*; L92 2*; L97 1*; L101 1*; R182#2 1*; R201 1; R204 2*; R206 2; R208 1*; R210 2*

### Buses and harness runs
bus IO_Hall[16..1] = port IO_Hall[16..1]

### Notes on the sheet
- Labels drawn without touching a wire or pin: ADC_BUSY, ADC_CNV, ADC_SCK, ADC_SDO, MUX_A0, MUX_A1, MUX_A2, POK, SWITCH_IN
- Подп. и дата
- Инв. № дубл.
- Взам. инв. №
- Инв. № подл.
- Изм.
- Лист
- № докум.
- Подп.
- Дата
- Копировал
- Формат А2

### Library data of the parts
C339 C340 C346 C347 C354 C355 C357 C359 = C0805: as C112#2 on sheet RFCtl; Value: 100nF; Price: 2
D5 = BZV55C: Чип cтабилитрон; Vendor: LGE; Value: 3V0; Voltage: 3V; SMD Solders: 2; Solder Option: RM; Pkg: SOD80; Current: 5; Price: 5; Device: BZV55C; Name to order: BZV55C3V0
J1#2 = PCI_PMC_M: PCI Mezzanine Connector; IEEE 1386 MainBoard; Manufactuer: TE Connectivity; PartField: 120527-1; SolderOption: 2; Pkg: PMC Male (IEEE 1386); Value: PCI_PMC; Vendor: TE Connectivity
L25-L30 L86 = BLM21: SMD Ferrite bead 0805; Vendor: Vishay; Value: 1k; Pkg: SMD0805; SMD Solders: 2; Solder Option: RM; Price: 10; Device: BLM21
L88 L92 L97 L101 = BLM21: SMD Ferrite bead 0805; Vendor: Vishay; Value: DNP; Pkg: SMD0805; SMD Solders: 2; Solder Option: RM; Price: 10; Device: BLM21
R48 R52 R80#2 R83#2 R97#2 R98#2 R102 R103#2 R110#2 R117#2 R125#2 R129#2 R135#2 R137#2 R168#2 R173#2 R181#2 R182#2 R187 R188 R197 R198 R201 R204 R207-R209 R212 = R0805: Чип резистор 0805; Vendor: Vishay; SMD Solders: 2; Solder Option: i; TC: 100ppm/C; Tolerance: 1%; Pkg: SMD0805; Pwr: 125mW; Device: Res0805; Price: 2
  R48 R98#2: Value: 10k
  R52 R80#2 R83#2 R97#2 R102 R103#2 R110#2 R117#2 R125#2 R135#2 R168#2 R173#2 R187 R197 R198: Value: 1k
  R129#2 R137#2 R181#2 R182#2 R188 R201 R204 R207-R209 R212: Value: DNP
R113#2 R121 R123#2 R195 R196 R202 R203 R206 R210 R213 R214 R526-R533 = R0805: as R335-R337 on sheet RFCtl; Price: 2
  R113#2: Value: 1k
  R121 R123#2 R195 R196 R202 R203 R213 R214: Value: 10k
  R206 R210: Value: DNP
  R526 R528-R533: Value: 0
  R527: Value: 100k
U4 U19#2 U24#2 U26#2 = SN74AVC4T774: Двунаправленный буфер; Pkg: TSSOP16; SMD Solders: 16; Solder Option: RM; THD Solders: 0; Vendor: Texas Instruments; Voltage: 1V1.. 3.6V  I/Os are 4.6-V Tolerant; Name to order: SN74AVC4T774PW; Device: SN74AVC4T774; Price: 300

## Sheet DCDC_Hall.SchDoc
size 420 x 297 mm; Address1: Address1; Address2: Address2; Address3: Address3; Address4: Address4; SheetNumber: 1; Scale: 1:1; Разраб.: Иванов; Обозначение документа: АБВГ.123456.001 Э3; Пров.: Петров; Утв.: Сидоров; Наименование организации: ОАО "Концерн "МПО-Гидроприбор"; Перв. применение: АБВГ.123456.000; Наименование изделия 1: Плата; Наименование изделия 2: Схема электрическая; Наименование изделия 3: принципиальная; Нач. отд.: Нач. отд.; Фамилия нач. отд.: Сидоров
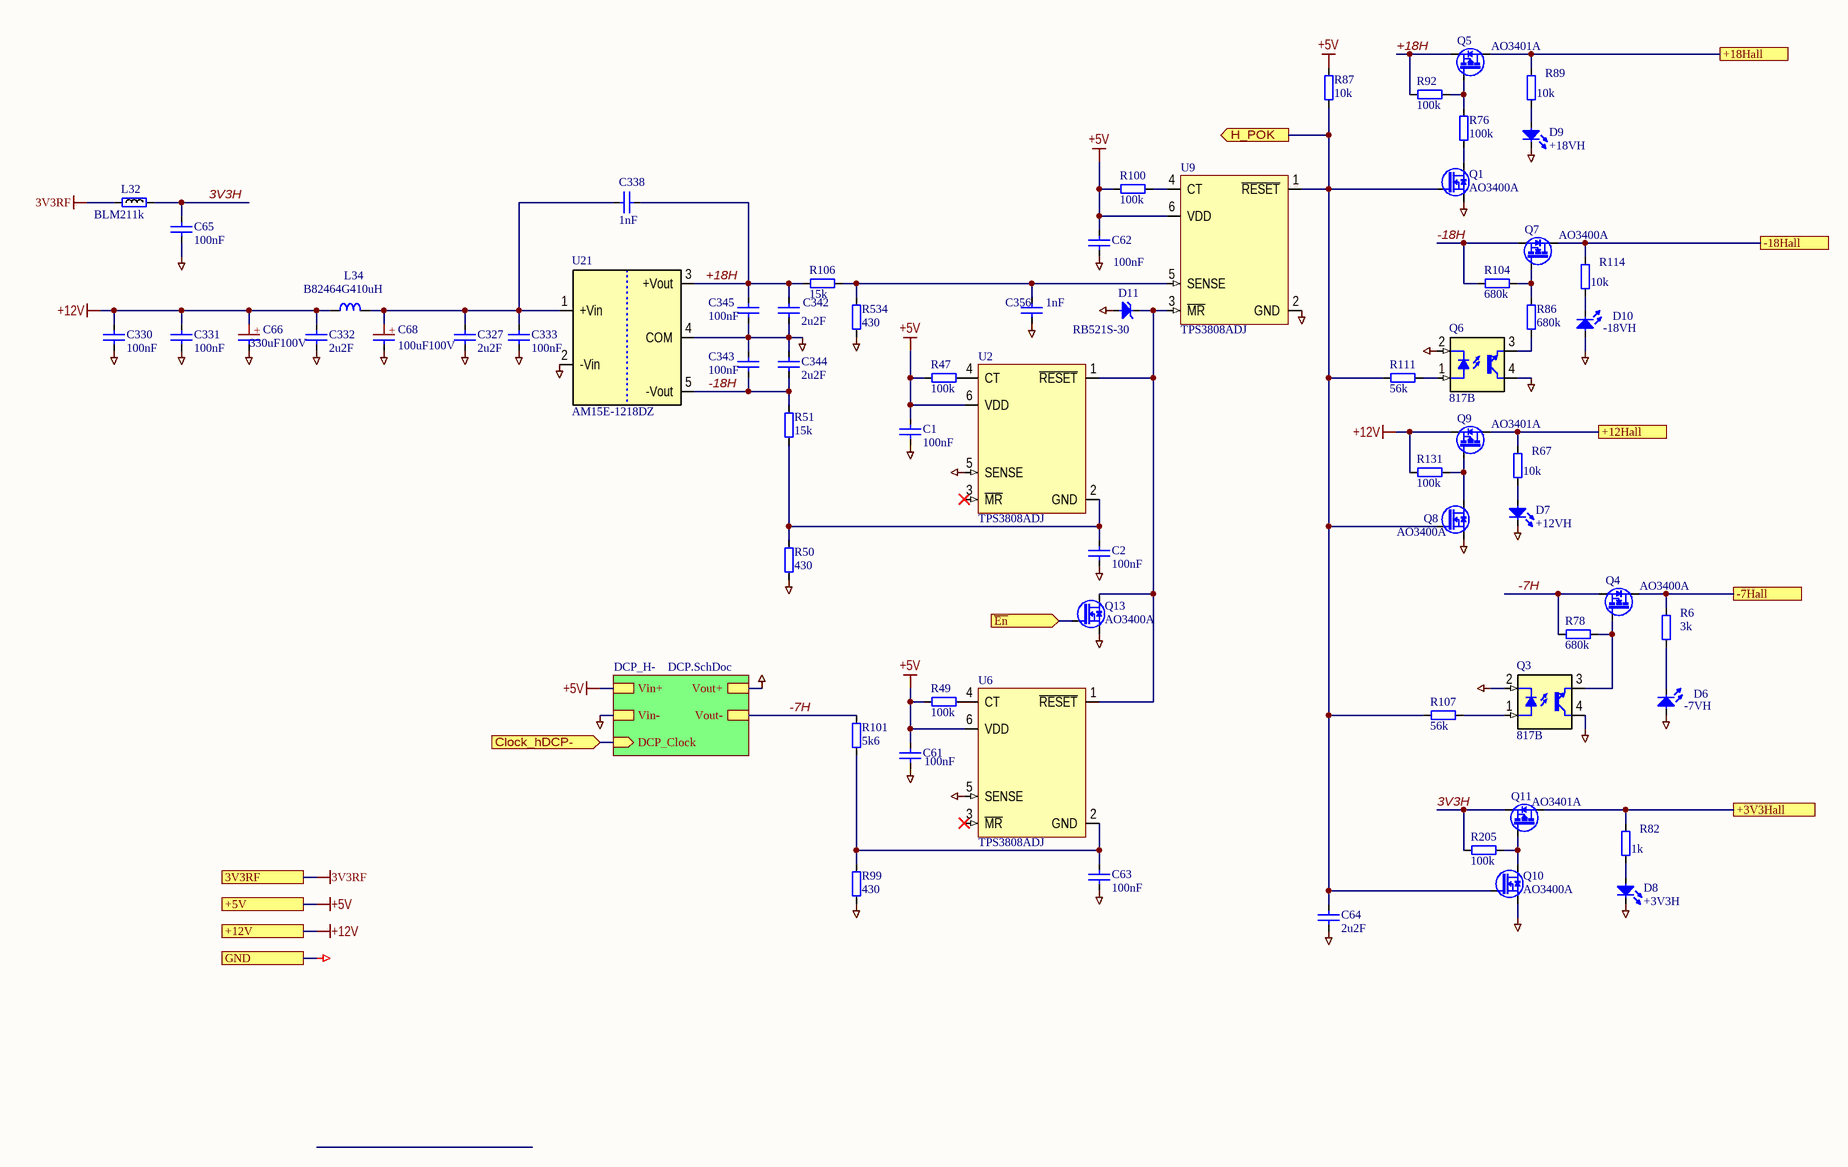
[diagram p17: DCDC_Hall.SchDoc]

### Parts
(Parts that share a designator on the sheet are numbered #1, #2 ... from top to bottom, then left to right.)
C1  100nF  [SMD0805CAP]
C2  100nF  [SMD0805CAP]
C61  100nF  [SMD0805CAP]
C62  100nF  [SMD0805CAP]
C63  100nF  [SMD0805CAP]
C64  2u2F  [SMD0805CAP]
C65  100nF  [SMD0805CAP]
C66  330uF100V  [CAPPR750-1600X2000]
C68  100uF100V  [CAPPR500-1000X1250]
C327  2u2F  [SMD0805CAP]
C330  100nF  [SMD0805CAP]
C331  100nF  [SMD0805CAP]
C332  2u2F  [SMD0805CAP]
C333  100nF  [SMD0805CAP]
C338  1nF  [SMD0805CAP]
C342  2u2F  [SMD0805CAP]
C343  100nF  [SMD0805CAP]
C344  2u2F  [SMD0805CAP]
C345  100nF  [SMD0805CAP]
C356  1nF  [SMD0805CAP]
D6  -7VH  [LED0603]
D7  +12VH  [LED0603]
D8  +3V3H  [LED0603]
D9  +18VH  [LED0603]
D10  -18VH  [LED0603]
D11  RB521S-30  [SODFL1608X65N]
L32  BLM211k  [RESC2012X50N]
L34  B82464G410uH  [IND_COILCRAFT_MSS1038]
Q1  AO3400A  [SOT95P229X119-3N]
Q3  817B  [DIP4-300]
Q4  AO3400A  [SOT95P229X119-3N]
Q5  AO3401A  [SOT95P229X119-3N]
Q6  817B  [DIP4-300]
Q7  AO3400A  [SOT95P229X119-3N]
Q8  AO3400A  [SOT95P229X119-3N]
Q9  AO3401A  [SOT95P229X119-3N]
Q10  AO3400A  [SOT95P229X119-3N]
Q11  AO3401A  [SOT95P229X119-3N]
Q13  AO3400A  [SOT95P229X119-3N]
R6  3k  [SMD0805RES]
R47  100k  [SMD0805RES]
R49  100k  [SMD0805RES]
R50  430  [SMD0805RES]
R51  15k  [SMD0805RES]
R67#2  10k  [SMD0805RES]
R76#2  100k  [SMD0805RES]
R78#2  680k  [SMD0805RES]
R82#2  1k  [SMD0805RES]
R86#2  680k  [SMD0805RES]
R87#2  10k  [SMD0805RES]
R89#2  10k  [SMD0805RES]
R92#2  100k  [SMD0805RES]
R99  430  [SMD0805RES]
R100  100k  [SMD0805RES]
R101#2  5k6  [SMD0805RES]
R104#2  680k  [SMD0805RES]
R106#2  15k  [SMD0805RES]
R107  56k  [SMD0805RES]
R111#2  56k  [SMD0805RES]
R114#2  10k  [SMD0805RES]
R131#2  100k  [SMD0805RES]
R205  100k  [SMD0805RES]
R534  430  [SMD0805RES]
U2  TPS3808ADJ  [SOT95P270X145-6N]
U6  TPS3808ADJ  [SOT95P270X145-6N]
U9  TPS3808ADJ  [SOT95P270X145-6N]
U21#2  AM15E-1218DZ  [DCDC_Aimtec_Dual]

### Sub-sheets
DCP_H- = DCP.SchDoc: DCP_Clock (in), Vout+, Vout-, Vin-, Vin+

### Ports
3V3RF, +3V3Hall, +5V, +12Hall, +12V, +18Hall, -7Hall, -18Hall, Clock_hDCP- (in), GND, H_POK (out), ~{En} (in)

### Nets
3V3RF: L32.2 ; port 3V3RF
+5V: C1.2 C61.2 C62.2 R47.1 R49.1 R87#2.1 R100.1 U2.6(VDD) U6.6(VDD) U9.6(VDD) ; port +5V, sheet DCP_H-/Vin+  [project net +5VME]
+12V: C66.1(+) C330.2 C331.2 C332.2 L34.1 Q9.2(S) R131#2.2 ; port +12V  [project net +12Vin]
GND: C1.1 C2.2 C61.1 C62.1 C63.2 C64.2 C65.1 C66.2 C68.2 C327.1 C330.1 C331.1 C332.1 C333.2 C342.1 C343.1 C344.2 C345.2 C356.1 D6.2(A) D7.1(C) D8.1(C) D9.1(C) D10.2(A) D11.2(A) Q1.2(S) Q3.2(C) Q3.4(C) Q6.2(C) Q6.4(C) Q8.2(S) Q10.2(S) Q13.2(S) R50.1 R99.1 R534.1 U2.5(SENSE) U6.5(SENSE) U9.2(GND) U21#2.2(-Vin) U21#2.4(COM) ; port GND, sheet DCP_H-/Vout+, sheet DCP_H-/Vin-  [project net POK_int]
3V3H: C65.2 L32.1 Q11.2(S) R205.2
+3V3Hall: Q11.3(D) R82#2.2 ; port +3V3Hall
+12Hall: Q9.3(D) R67#2.2 ; port +12Hall
+18H: C338.2 C342.2 C345.1 Q5.2(S) R92#2.2 R106#2.2 U21#2.3(+Vout)
+18Hall: Q5.3(D) R89#2.2 ; port +18Hall
-7H: Q4.2(S) R78#2.2 R101#2.1 ; sheet DCP_H-/Vout-
-7Hall: Q4.3(D) R6.2 ; port -7Hall
-18H: C343.2 C344.1 Q7.2(S) R51.1 R104#2.2 U21#2.5(-Vout)
-18Hall: Q7.3(D) R114#2.2 ; port -18Hall
~{En}: Q13.1(G) ; port ~{En}
Clock_hDCP-: port Clock_hDCP-, sheet DCP_H-/DCP_Clock
H_POK: C64.1 Q1.1(G) Q8.1(G) Q10.1(G) R87#2.2 R107.1 R111#2.1 U9.1(~{RESET}) ; port H_POK
NetC2_1: C2.1 R50.2 R51.2 U2.2(GND)
NetC63_1: C63.1 R99.2 R101#2.2 U6.2(GND)
NetC68_1: C68.1(+) C327.2 C333.1 C338.1 L34.2 U21#2.1(+Vin)
NetC356_2: C356.2 R106#2.1 R534.2 U9.5(SENSE)
NetD6_1: D6.1(C) R6.1
NetD7_2: D7.2(A) R67#2.1
NetD8_2: D8.2(A) R82#2.1
NetD9_2: D9.2(A) R89#2.1
NetD10_1: D10.1(C) R114#2.1
NetD11_1: D11.1(C) Q13.3(D) U2.1(~{RESET}) U6.1(~{RESET}) U9.3(~{MR})
NetQ1_3: Q1.3(D) R76#2.1
NetQ3_1: Q3.1(A) R107.2
NetQ3_3: Q3.3(E) Q4.1(G) R78#2.1
NetQ5_1: Q5.1(G) R76#2.2 R92#2.1
NetQ6_1: Q6.1(A) R111#2.2
NetQ6_3: Q6.3(E) R86#2.1
NetQ7_1: Q7.1(G) R86#2.2 R104#2.1
NetQ8_3: Q8.3(D) Q9.1(G) R131#2.1
NetQ10_3: Q10.3(D) Q11.1(G) R205.1
NetR47_2: R47.2 U2.4(CT)
NetR49_2: R49.2 U6.4(CT)
NetR100_2: R100.2 U9.4(CT)

Not connected (* = marked no-connect by the designer): U2 3(~{MR})*; U6 3(~{MR})*

### Notes on the sheet
- Подп. и дата
- Инв. № дубл.
- Взам. инв. №
- Инв. № подл.
- Изм.
- Лист
- № докум.
- Подп.
- Дата
- Копировал
- Формат А3

### Library data of the parts
C1 C2 C61-C65 C327 C330-C333 C338 C342-C345 C356 = C0805: as C112#2 on sheet RFCtl; Price: 2
  C1 C2 C61-C63 C65 C330 C331 C333 C343 C345: Value: 100nF
  C64 C327 C332 C342 C344: Value: 2u2F
  C338 C356: Value: 1nF
C66 = CAP_POL_7_5x16: Конденсатор полярный d16 p7.5мм; Voltage: 100V; Vendor: Vishay; Value: 330uF; SMD Solders: 0; Solder Option: RM; Tolerance: 20%; Pkg: 7.5x16mm; Device: Cap+; THD Solders: 2; Price: 30
C68 = CAP_POL_5x10: Конденсатор полярный d10 p5мм; Voltage: 100V; Vendor: Vishay; Value: 100uF; SMD Solders: 0; Solder Option: RM; Tolerance: 20%; Pkg: 5x10mm; Device: Cap+; THD Solders: 2; Price: 20
D6-D10 = LED0603: Чип светодиод 0603; Vendor: KB; SMD Solders: 2; Solder Option: RM; Pkg: SMD0603; Price: 10; Device: LED0603
  D6: Value: -7VH
  D7: Value: +12VH
  D8: Value: +3V3H
  D9: Value: +18VH
  D10: Value: -18VH
D11 = RB521S-30: Чип Шоттки диод; Vendor: CTK; Voltage: 30V; SMD Solders: 2; Solder Option: RM; Pkg: SOD523; Price: 5; Device: RB521S-30; Name to order: RB521S-30
L32 = BLM21: as L25-L30 on sheet Hall; Price: 10; Device: BLM21
L34 = B82464G4: SMD Дроссель; Vendor: Epcos; Value: 10uH; Voltage: 2; Solder Option: RM; Tolerance: 20%; Pkg: SMD10.4x10.4mm; THD Solders: 0; Name to order: B82464G4103M; Current: 3A5; Price: 400; SMD Solders: 2; Device: B82464G4
Q1 Q4 Q7 Q8 Q10 Q13 = AO3400A: NMOS; Vendor: UMW; Pkg: SOT23; SMD Solders: 3; Solder Option: RM; Voltage: 30V; Price: 10; Device: AO3400A; Name to order: AO3400A
Q3 Q6 = 817B: Optotransistor; Pkg: DIP4; SMD Solders: 0; Solder Option: RM; THD Solders: 4; Vendor: UMW; Voltage: 35V; Device: 817B; Price: 10; Name to order: 817B; Current: 0
Q5 Q9 Q11 = AO3401A: PMOS; Vendor: UMW; Pkg: SOT23; SMD Solders: 3; Solder Option: RM; THD Solders: 0; Voltage: -30V; Price: 10; Device: AO3401A; Name to order: AO3401A
R6 R47 R49-R51 R67#2 R76#2 R78#2 R82#2 R86#2 R87#2 R89#2 R92#2 R99 R100 R101#2 R104#2 R106#2 R107 R111#2 R114#2 R131#2 R205 R534 = R0805: as R335-R337 on sheet RFCtl; Price: 2
  R6: Value: 3k
  R47 R49 R76#2 R92#2 R100 R131#2 R205: Value: 100k
  R50 R99 R534: Value: 430
  R51 R106#2: Value: 15k
  R67#2 R87#2 R89#2 R114#2: Value: 10k
  R78#2 R86#2 R104#2: Value: 680k
  R82#2: Value: 1k
  R101#2: Value: 5k6
  R107 R111#2: Value: 56k
U2 U6 U9 = TPS3808: as U63 on sheet RFCtl; Price: 200; Device: TPS3808
U21#2 = AM15E-: DC-DC+&-Halvoisolated out; Vendor: Aimtec; Value: 1218DZ; Pkg: DCDC_5; SMD Solders: 0; Solder Option: RM; THD Solders: 5; Name to order: AM15-1218DZ; Price: 2000; Device: AM15E-

## Sheet DCP.SchDoc
size 209 x 297 mm; Address1: Address1; Address2: Address2; Address3: Address3; Address4: Address4; SheetNumber: 1; Scale: 1:1; Разраб.: Иванов; Обозначение документа: АБВГ.123456.001 Э3; Пров.: Петров; Утв.: Сидоров; Наименование организации: ОАО "Концерн "МПО-Гидроприбор"; Перв. применение: АБВГ.123456.000; Наименование изделия 1: Плата; Наименование изделия 2: Схема электрическая; Наименование изделия 3: принципиальная; Нач. отд.: Нач. отд.; Фамилия нач. отд.: Сидоров
Used 7 times, as channels RF_Ctl/RF_H/H_DCDC/DCP_H-, RF_Ctl/RF_i/i_DCDC/DCP_i-, RF_Ctl/RF_i/i_DCDC/DCP_i+, RF_Ctl/RF_D/D_DCDC/DCP_D+, RF_Ctl/RF_D/D_DCDC/DCP_D-, RF_Ctl/RF_S/S_DCDC/DCP_S+, RF_Ctl/RF_S/S_DCDC/DCP_S-. Parts and nets are listed once, with the designators drawn on the sheet.
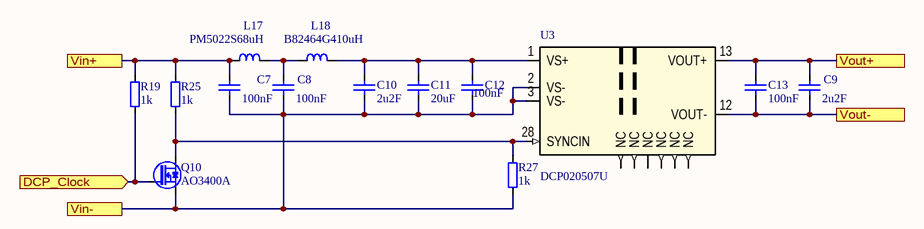
[diagram p18: DCP.SchDoc]

### Parts
C7  100nF  [SMD0805CAP]
C8  100nF  [SMD0805CAP]
C9  2u2F  [SMD0805CAP]
C10  2u2F  [SMD0805CAP]
C11  20uF  [CAPC1206]
C12  100nF  [SMD0805CAP]
C13  100nF  [SMD0805CAP]
L17  PM5022S68uH  [IND_Bourns_PM5022S]
L18  B82464G410uH  [IND_COILCRAFT_MSS1038]
Q10  AO3400A  [SOT95P229X119-3N]
R19  1k  [SMD0805RES]
R25  1k  [SMD0805RES]
R27  1k  [SMD0805RES]
U3  DCP020507U  [SOIC127P1033X265-12_28N]

### Ports
DCP_Clock (in), Vin+, Vin-, Vout+, Vout-

### Nets
DCP_Clock: Q10.1(G) R19.2 ; port DCP_Clock
Vin+: C7.2 L17.1 R19.1 R25.1 ; port Vin+
Vin-: C7.1 C8.1 C10.1 C11.1 C12.1 Q10.2(S) R27.2 U3.2(VS-) U3.3(VS-) ; port Vin-
Vout+: C9.2 C13.2 U3.13(VOUT+) ; port Vout+
Vout-: C9.1 C13.1 U3.12(VOUT-) ; port Vout-
NetC8_2: C8.2 L17.2 L18.1
NetC10_2: C10.2 C11.2 C12.2 L18.2 U3.1(VS+)
NetQ10_3: Q10.3(D) R25.2 R27.1 U3.28(SYNCIN)

Not connected (* = marked no-connect by the designer): U3 14(NC) 15(NC) 16(NC) 17(NC) 26(NC) 27(NC)

### Channels
RF_Ctl/RF_H/H_DCDC/DCP_H-: designators end in _DCP_H-; ports DCP_Clock=Clock_hDCP- Vin+=+5VME Vin-=POK_int Vout+=POK_int Vout-=-7H
RF_Ctl/RF_i/i_DCDC/DCP_i-: designators end in _DCP_i-; ports DCP_Clock=Clock_iDCP- Vin+=+5VME Vin-=POK_int Vout+=intG Vout-=-7i
RF_Ctl/RF_i/i_DCDC/DCP_i+: designators end in _DCP_i+; ports DCP_Clock=Clock_iDCP+ Vin+=+5VME Vin-=POK_int Vout+=intG Vout-=+7H
RF_Ctl/RF_D/D_DCDC/DCP_D+: designators end in _DCP_D+; ports DCP_Clock=NetQ10_DCP_D+_1 Vin+=+5VME Vin-=POK_int Vout+=+7D Vout-=POK_int
RF_Ctl/RF_D/D_DCDC/DCP_D-: designators end in _DCP_D-; ports DCP_Clock=NetQ10_DCP_D+_1 Vin+=+5VME Vin-=POK_int Vout+=POK_int Vout-=-7D
RF_Ctl/RF_S/S_DCDC/DCP_S+: designators end in _DCP_S+; ports DCP_Clock=NetQ10_DCP_S+_1 Vin+=+5VME Vin-=POK_int Vout+=+7_ Vout-=POK_int
RF_Ctl/RF_S/S_DCDC/DCP_S-: designators end in _DCP_S-; ports DCP_Clock=NetQ10_DCP_S+_1 Vin+=+5VME Vin-=POK_int Vout+=POK_int Vout-=-7_

### Notes on the sheet
- Перв. примен.
- Справ. №
- Подп. и дата
- Инв. № дубл.
- Взам. инв. №
- Инв. № подл.
- Изм.
- Лист
- № докум.
- Подп.
- Дата
- Копировал
- Формат А4

### Library data of the parts
C7-C10 C12 C13 = C0805: as C112#2 on sheet RFCtl; Price: 2
  C7 C8 C12 C13: Value: 100nF
  C9 C10: Value: 2u2F
C11 = C1206: Чип конденсатор 0805; Voltage: 16V; Vendor: Vishay; DielectricType: X5R; SMD Solders: 2; Solder Option: RM; Tolerance: 1%; Pkg: SMD1206; Device: Cap1206; Value: 20uF; Price: 2
L17 = IND_BOURNS_PM5022S: SMD Дроссель; Vendor: Panasonic; Value: 68uH; Voltage: 2; Solder Option: RM; Tolerance: 20%; Pkg: SMD13x13mm; THD Solders: 0; Name to order: PM5022s-680M-RM; Current: 1A6; Price: 400; SMD Solders: 2; Device: PM5022S
L18 = B82464G4: as L34 on sheet DCDC_Hall; Price: 400; SMD Solders: 2; Device: B82464G4
Q10 = AO3400A: as Q1 on sheet DCDC_Hall; Price: 10; Device: AO3400A; Name to order: AO3400A
R19 R25 R27 = R0805: as R335-R337 on sheet RFCtl; Price: 2; Value: 1k
U3 = DCP02xxyyU: DC/DC xxV to isolated  yyV; Vendor: Texas Instruments; Value: 0507U; Device: DCP02; Pkg: SOIC28; SMD Solders: 6; Solder Option: RM; Voltage: 7V; Copyright: Copyright (C) 2022 Ultra Librarian. All rights reserved.; Price: 1000

## Sheet Integrator.SchDoc
size 594 x 420 mm; Address1: Address1; Address2: Address2; Address3: Address3; Address4: Address4; SheetNumber: 1; Scale: 1:1; Разраб.: Иванов; Обозначение документа: АБВГ.123456.001 Э3; Пров.: Петров; Утв.: Сидоров; Наименование организации: ОАО "Концерн "МПО-Гидроприбор"; Перв. применение: АБВГ.123456.000; Наименование изделия 1: Плата; Наименование изделия 2: Схема электрическая; Наименование изделия 3: принципиальная; Нач. отд.: Нач. отд.; Фамилия нач. отд.: Сидоров
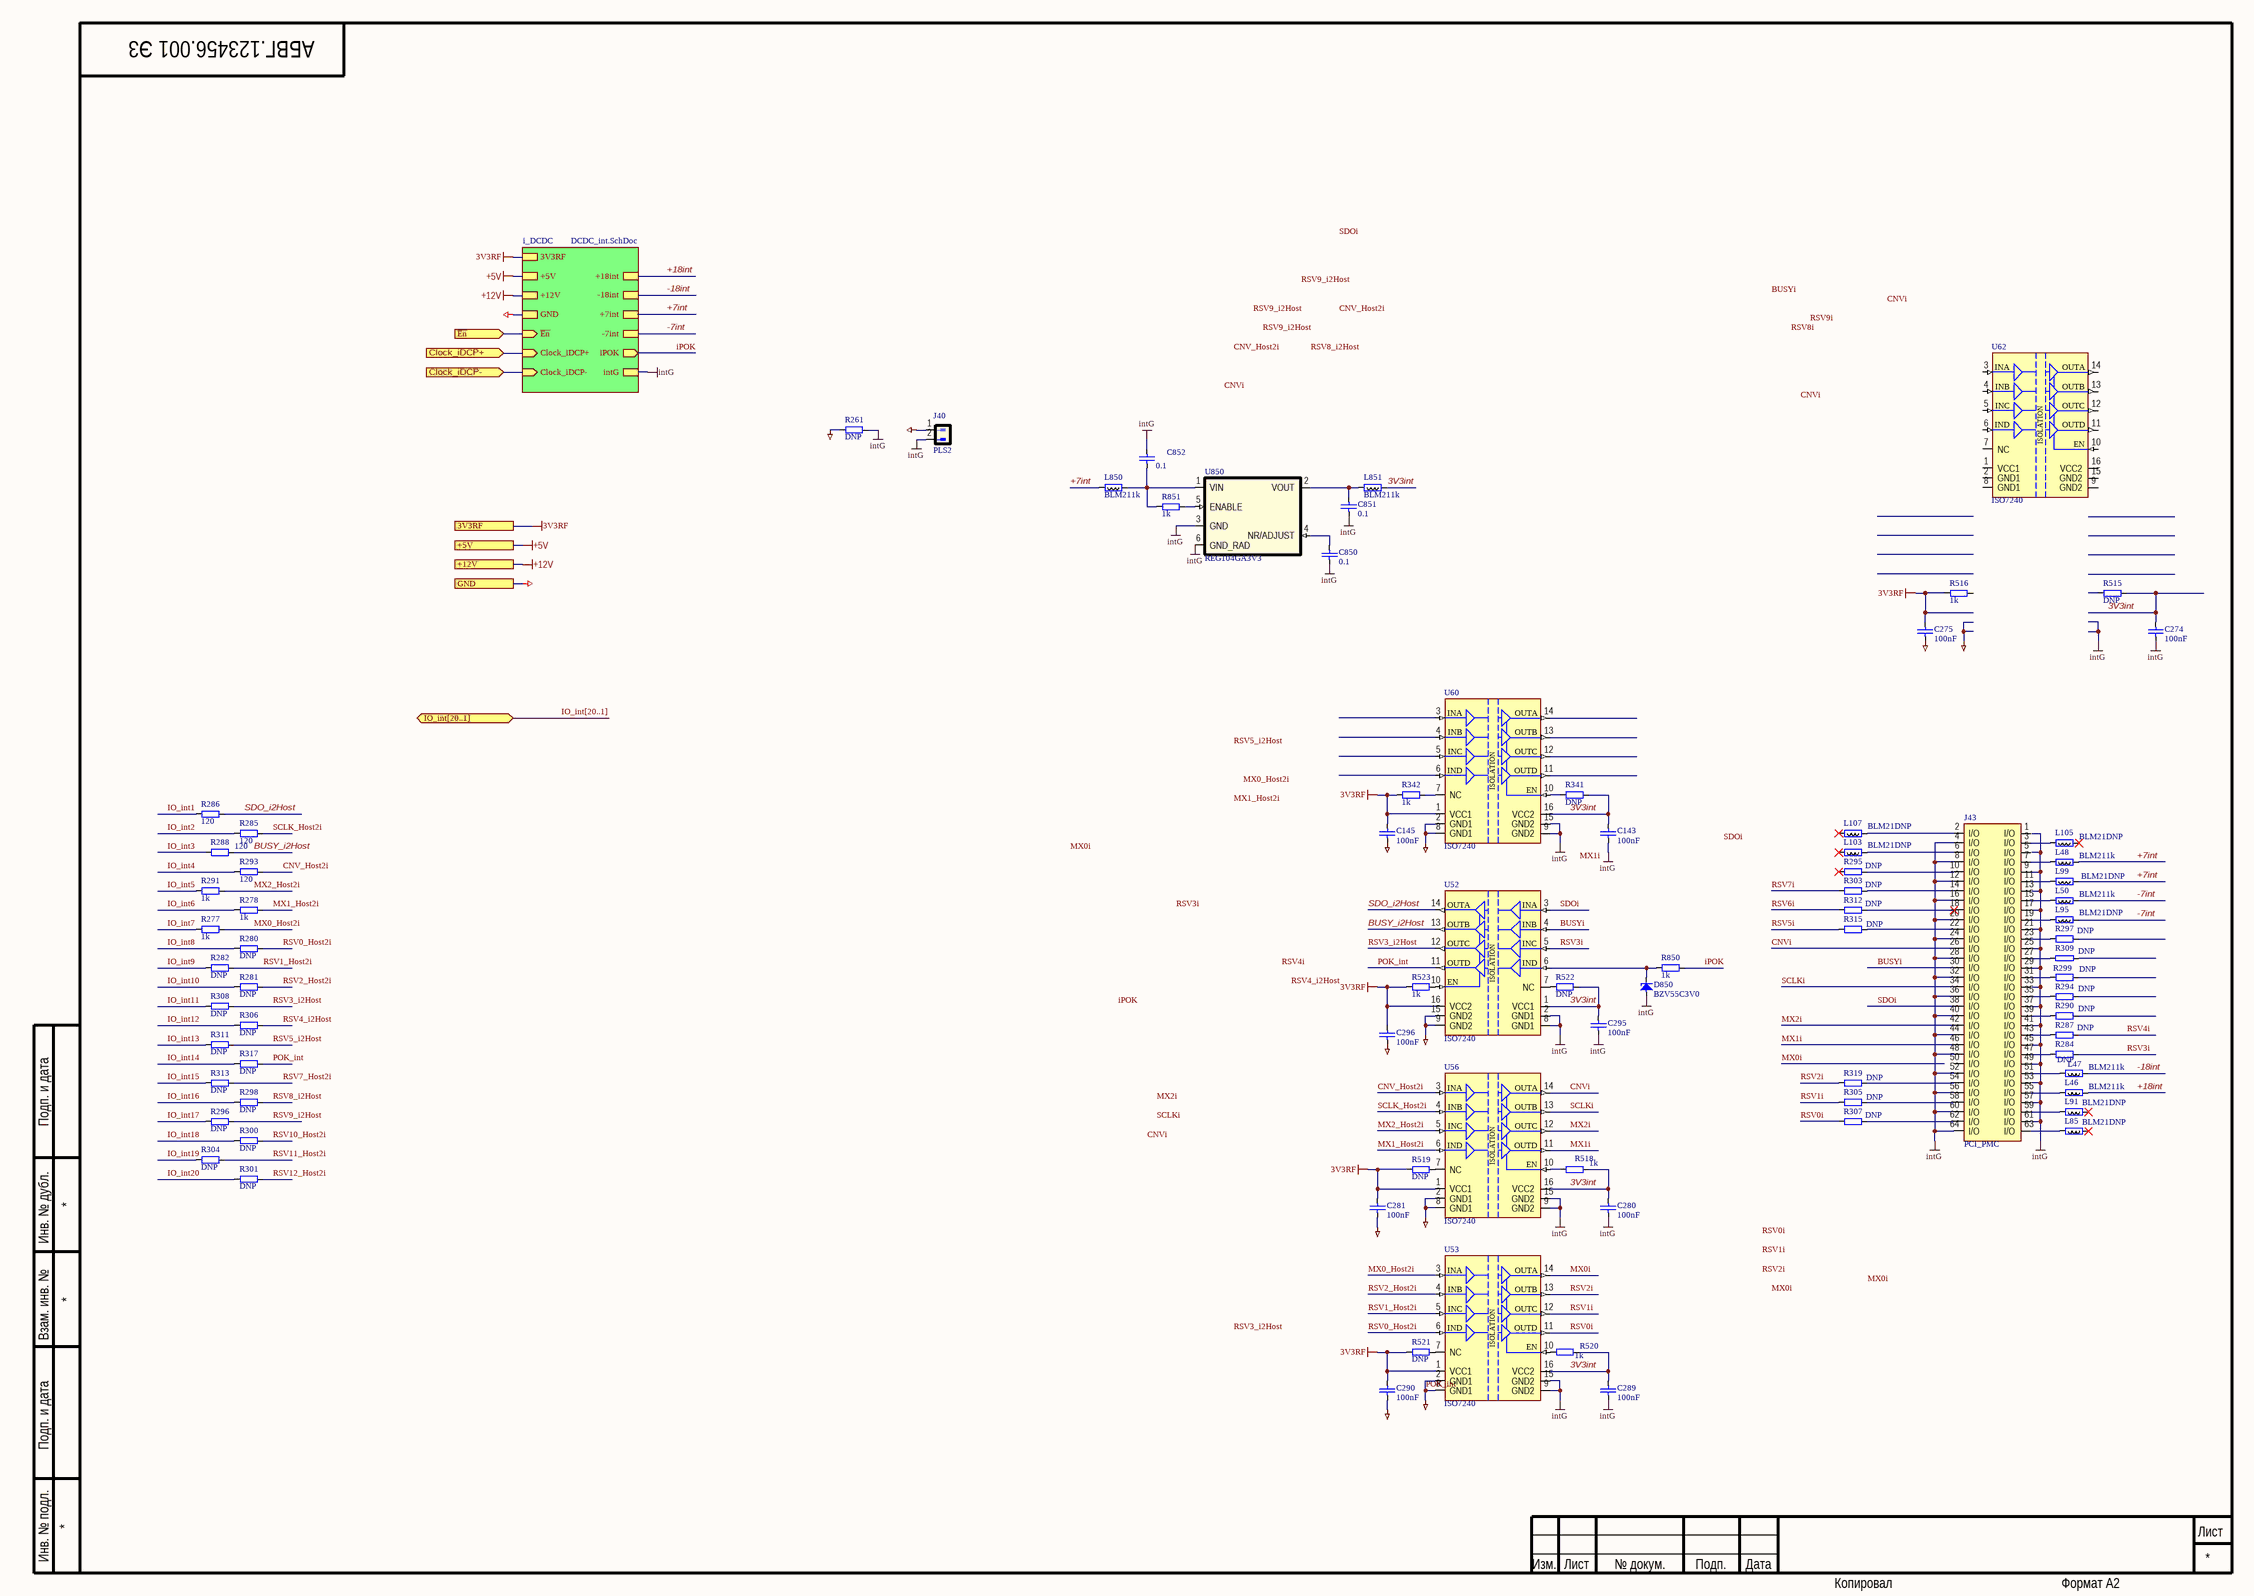
[diagram p19: Integrator.SchDoc]

### Parts
(Parts that share a designator on the sheet are numbered #1, #2 ... from top to bottom, then left to right.)
C143#2  100nF  [SMD0805CAP]
C145#2  100nF  [SMD0805CAP]
C274  100nF  [SMD0805CAP]
C275  100nF  [SMD0805CAP]
C280  100nF  [SMD0805CAP]
C281  100nF  [SMD0805CAP]
C289  100nF  [SMD0805CAP]
C290  100nF  [SMD0805CAP]
C295  100nF  [SMD0805CAP]
C296  100nF  [SMD0805CAP]
C850  0.1  [SMD0805CAP]
C851  0.1  [SMD0805CAP]
C852  0.1  [SMD0805CAP]
D850  BZV55C3V0  [DIOMELF3516N]
J40  PLS2  [PLS2]
J43  PCI_PMC  [TYCO_120521-1]
L46  BLM211k  [RESC2012X50N]
L47  BLM211k  [RESC2012X50N]
L48  BLM211k  [RESC2012X50N]
L50  BLM211k  [RESC2012X50N]
L85  BLM21DNP  [RESC2012X50N]
L91  BLM21DNP  [RESC2012X50N]
L95  BLM21DNP  [RESC2012X50N]
L99  BLM21DNP  [RESC2012X50N]
L103  BLM21DNP  [RESC2012X50N]
L105  BLM21DNP  [RESC2012X50N]
L107  BLM21DNP  [RESC2012X50N]
L850  BLM211k  [RESC2012X50N]
L851  BLM211k  [RESC2012X50N]
R261  DNP  [SMD0805RES]
R277  1k  [SMD0805RES]
R278  1k  [SMD0805RES]
R280  DNP  [SMD0805RES]
R281  DNP  [SMD0805RES]
R282  DNP  [SMD0805RES]
R284  DNP  [SMD0805RES]
R285  120  [SMD0805RES]
R286  120  [SMD0805RES]
R287  DNP  [SMD0805RES]
R288  120  [SMD0805RES]
R290  DNP  [SMD0805RES]
R291  1k  [SMD0805RES]
R293  120  [SMD0805RES]
R294  DNP  [SMD0805RES]
R295  DNP  [SMD0805RES]
R296  DNP  [SMD0805RES]
R297  DNP  [SMD0805RES]
R298  DNP  [SMD0805RES]
R299  DNP  [SMD0805RES]
R300  DNP  [SMD0805RES]
R301  DNP  [SMD0805RES]
R303  DNP  [SMD0805RES]
R304  DNP  [SMD0805RES]
R305  DNP  [SMD0805RES]
R306  DNP  [SMD0805RES]
R307  DNP  [SMD0805RES]
R308  DNP  [SMD0805RES]
R309  DNP  [SMD0805RES]
R311  DNP  [SMD0805RES]
R312  DNP  [SMD0805RES]
R313  DNP  [SMD0805RES]
R315  DNP  [SMD0805RES]
R317  DNP  [SMD0805RES]
R319  DNP  [SMD0805RES]
R341  DNP  [SMD0805RES]
R342  1k  [SMD0805RES]
R515  DNP  [SMD0805RES]
R516  1k  [SMD0805RES]
R518  1k  [SMD0805RES]
R519  DNP  [SMD0805RES]
R520  1k  [SMD0805RES]
R521  DNP  [SMD0805RES]
R522  DNP  [SMD0805RES]
R523  1k  [SMD0805RES]
R850  1k  [SMD0805RES]
R851  1k  [SMD0805RES]
U52  ISO7240  [SOIC127P1030X265-16N]
U53  ISO7240  [SOIC127P1030X265-16N]
U56  ISO7240  [SOIC127P1030X265-16N]
U60  ISO7240  [SOIC127P1030X265-16N]
U62  ISO7240  [SOIC127P1030X265-16N]
U850  REG104GA3V3  [SOT223_6-127]

### Sub-sheets
i_DCDC = DCDC_int.SchDoc: +18int, -18int, -7int, +7int, ~{En} (in), Clock_iDCP- (in), Clock_iDCP+ (in), +5V, +12V, GND, 3V3RF, intG, iPOK (out)

### Ports
3V3RF, +5V, +12V, Clock_iDCP+ (in), Clock_iDCP- (in), GND, IO_int[20..1] (bidir), ~{En} (in)

### Nets
3V3RF: C145#2.2 C275.2 C281.2 C290.2 C296.2 R342.1 R516.1 R519.1 R521.1 R523.1 U52.16(VCC2) U53.1(VCC1) U56.1(VCC1) U60.1(VCC1) ; port 3V3RF, sheet i_DCDC/3V3RF
+5V: port +5V, sheet i_DCDC/+5V  [project net +5VME]
+12V: port +12V, sheet i_DCDC/+12V  [project net +12Vin]
intG: C143#2.1 C274.1 C280.1 C289.1 C295.1 C850.2 C851.2 C852.2 D850.2(A) J40.2 J43.4(I/O) J43.8(I/O) J43.12(I/O) J43.16(I/O) J43.20(I/O) J43.24(I/O) J43.28(I/O) J43.32(I/O) J43.36(I/O) J43.40(I/O) J43.44(I/O) J43.48(I/O) J43.52(I/O) J43.56(I/O) J43.60(I/O) J43.64(I/O) R261.2 U52.2(GND1) U52.8(GND1) U53.9(GND2) U53.15(GND2) U56.9(GND2) U56.15(GND2) U60.9(GND2) U60.15(GND2) U850.3(GND) U850.6(GND_RAD) ; sheet i_DCDC/intG
POK_int: C145#2.1 C275.1 C281.1 C290.1 C296.1 J40.1 R261.1 R317.2 U52.9(GND2) U52.11(OUTD) U52.15(GND2) U53.2(GND1) U53.8(GND1) U56.2(GND1) U56.8(GND1) U60.2(GND1) U60.8(GND1) ; port GND, sheet i_DCDC/GND  [also labelled GND]
3V3int: C143#2.2 C274.2 C280.2 C289.2 C295.2 L851.2 R341.2 R515.2 R518.2 R520.2 R522.2 U52.1(VCC1) U53.16(VCC2) U56.16(VCC2) U60.16(VCC2)
+7int: L48.2 L99.2 L850.1 ; sheet i_DCDC/+7int
+18int: L46.2 ; sheet i_DCDC/+18int
-7int: L50.2 L95.2 ; sheet i_DCDC/-7int
-18int: L47.2 ; sheet i_DCDC/-18int
~{En}: port ~{En}, sheet i_DCDC/~{En}
BUSY_i2Host: R288.2 U52.13(OUTB)
BUSYi: J43.30(I/O) U52.4(INB)
Clock_iDCP+: port Clock_iDCP+, sheet i_DCDC/Clock_iDCP+
Clock_iDCP-: port Clock_iDCP-, sheet i_DCDC/Clock_iDCP-
CNV_Host2i: R293.2 U56.3(INA)
CNVi: J43.26(I/O) U56.14(OUTA)
IO_int1: R286.1  [project net IO_BL17]
IO_int2: R285.1  [project net IO_BL18]
IO_int3: R288.1  [project net IO_BL19]
IO_int4: R293.1
IO_int5: R291.1
IO_int6: R278.1
IO_int7: R277.1
IO_int8: R280.1
IO_int9: R282.1
IO_int10: R281.1
IO_int11: R308.1
IO_int12: R306.1
IO_int13: R311.1
IO_int14: R317.1
IO_int15: R313.1
IO_int16: R298.1
IO_int17: R296.1
IO_int18: R300.1
IO_int19: R304.1
IO_int20: R301.1
iPOK: R850.2 ; sheet i_DCDC/iPOK
MX0_Host2i: R277.2 U53.3(INA)
MX0i: U53.14(OUTA)
MX1_Host2i: R278.2 U56.6(IND)
MX1i: J43.46(I/O) U56.11(OUTD)
MX2_Host2i: R291.2 U56.5(INC)
MX2i: J43.42(I/O) U56.12(OUTC)
RSV0_Host2i: R280.2 U53.6(IND)
RSV0i: R307.1 U53.11(OUTD)
RSV1_Host2i: R282.2 U53.5(INC)
RSV1i: R305.1 U53.12(OUTC)
RSV2_Host2i: R281.2 U53.4(INB)
RSV2i: R319.1 U53.13(OUTB)
RSV3_i2Host: R308.2 U52.12(OUTC)
RSV3i: R284.2 U52.5(INC)
RSV4_i2Host: R306.2
RSV4i: R287.2
RSV5_i2Host: R311.2
RSV5i: R315.1
RSV6i: R312.1
RSV7_Host2i: R313.2
RSV7i: R303.1
RSV8_i2Host: R298.2
RSV9_i2Host: R296.2
RSV10_Host2i: R300.2
RSV11_Host2i: R304.2
RSV12_Host2i: R301.2
SCLK_Host2i: R285.2 U56.4(INB)
SCLKi: J43.34(I/O) U56.13(OUTB)
SDO_i2Host: R286.2 U52.14(OUTA)
SDOi: J43.38(I/O) U52.3(INA)
NetC850_1: C850.1 U850.4(NR/ADJUST)
NetC851_1: C851.1 L851.1 U850.2(VOUT)
NetC852_1: C852.1 L850.2 R851.1 U850.1(VIN)
NetD850_1: D850.1(C) R850.1 U52.6(IND)
NetJ43_2: J43.2(I/O) L107.2
NetJ43_3: J43.3(I/O) L105.1
NetJ43_6: J43.6(I/O) L103.2
NetJ43_7: J43.7(I/O) L48.1
NetJ43_10: J43.10(I/O) R295.2
NetJ43_11: J43.11(I/O) L99.1
NetJ43_14: J43.14(I/O) R303.2
NetJ43_15: J43.15(I/O) L50.1
NetJ43_18: J43.18(I/O) R312.2
NetJ43_19: J43.19(I/O) L95.1
NetJ43_22: J43.22(I/O) R315.2
NetJ43_23: J43.23(I/O) R297.1
NetJ43_27: J43.27(I/O) R309.2
NetJ43_31: J43.31(I/O) R299.1
NetJ43_35: J43.35(I/O) R294.1
NetJ43_39: J43.39(I/O) R290.1
NetJ43_43: J43.43(I/O) R287.1
NetJ43_47: J43.47(I/O) R284.1
NetJ43_51: J43.51(I/O) L47.1
NetJ43_54: J43.54(I/O) R319.2
NetJ43_55: J43.55(I/O) L46.1
NetJ43_58: J43.58(I/O) R305.2
NetJ43_59: J43.59(I/O) L91.1
NetJ43_62: J43.62(I/O) R307.2
NetJ43_63: J43.63(I/O) L85.1
NetR341_1: R341.1 U60.10(EN)
NetR342_2: R342.2 U60.7(NC)
NetR518_1: R518.1 U56.10(EN)
NetR519_2: R519.2 U56.7(NC)
NetR520_1: R520.1 U53.10(EN)
NetR521_2: R521.2 U53.7(NC)
NetR522_1: R522.1 U52.7(NC)
NetR523_2: R523.2 U52.10(EN)
NetR851_2: R851.2 U850.5(ENABLE)

Not connected (* = marked no-connect by the designer): J43 1(I/O) 5(I/O) 9(I/O) 13(I/O) 17(I/O) 21(I/O) 25(I/O) 29(I/O) 33(I/O) 37(I/O) 41(I/O) 45(I/O) 49(I/O) 50(I/O) 53(I/O) 57(I/O) 61(I/O); L85 2*; L91 2*; L103 1*; L105 2*; L107 1*; R290 2; R294 2; R295 1*; R297 2; R299 2; R309 1; R515 1; R516 2; U60 3(INA) 4(INB) 5(INC) 6(IND) 11(OUTD) 12(OUTC) 13(OUTB) 14(OUTA); U62 1(VCC1) 2(GND1) 3(INA) 4(INB) 5(INC) 6(IND) 7(NC) 8(GND1) 9(GND2) 10(EN) 11(OUTD) 12(OUTC) 13(OUTB) 14(OUTA) 15(GND2) 16(VCC2)

### Buses and harness runs
bus IO_int[20..1] = port IO_int[20..1]

### Notes on the sheet
- Labels drawn without touching a wire or pin: BUSYi, CNV_Host2i, CNVi, iPOK, MX0_Host2i, MX0i, MX1_Host2i, MX1i, MX2i, RSV0i, RSV1i, RSV2i, RSV3_i2Host, RSV3i, RSV4_i2Host, RSV4i, RSV5_i2Host, RSV8_i2Host, RSV8i, RSV9_i2Host, RSV9i, SCLKi, SDOi
- Подп. и дата
- Инв. № дубл.
- Взам. инв. №
- Инв. № подл.
- Изм.
- Лист
- № докум.
- Подп.
- Дата
- Копировал
- Формат А2
- (in symbol ISO7240M) ISOLATION

### Library data of the parts
C143#2 C145#2 C274 C275 C280 C281 C289 C290 C295 C296 C850-C852 = C0805: as C112#2 on sheet RFCtl; Price: 2
  C143#2 C145#2 C274 C275 C280 C281 C289 C290 C295 C296: Value: 100nF
  C850-C852: Value: 0.1
D850 = BZV55C: as D5 on sheet Hall; Price: 5; Device: BZV55C; Name to order: BZV55C3V0
J40 = PLS2: Vendor: Confly; SMD Solders: 0; Solder Option: RM; THD Solders: 2; Price: 1; Device: PLS2
J43 = PCI_PMC_M: as J1#2 on sheet Hall; Value: PCI_PMC; Vendor: TE Connectivity
L46-L48 L50 L850 L851 = BLM21: as L25-L30 on sheet Hall; Price: 10; Device: BLM21
L85 L91 L95 L99 L103 L105 L107 = BLM21: as L88 on sheet Hall; Price: 10; Device: BLM21
R261 R341 R515 R519 R521 R522 = R0805: as R48 on sheet Hall; Price: 2; Value: DNP
R277 R278 R280-R282 R284-R288 R290 R291 R293-R301 R303-R309 R311-R313 R315 R317 R319 R342 R516 R518 R520 R523 R850 R851 = R0805: as R335-R337 on sheet RFCtl; Price: 2
  R277 R278 R291 R342 R516 R518 R520 R523 R850 R851: Value: 1k
  R280-R282 R284 R287 R290 R294-R301 R303-R309 R311-R313 R315 R317 R319: Value: DNP
  R285 R286 R288 R293: Value: 120
U52 U53 U56 U60 U62 = ISO7240M: Двунаправленный буфер; Pkg: SOIC16DW; SMD Solders: 16; Solder Option: RM; THD Solders: 0; Vendor: Texas Instruments; Voltage: 3V3 or 5V; Name to order: ISO7240MDWR; Current: 30; Device: ISO7240; Price: 3500
U850 = REG104GA: Positive LDO Linear stabilizer; Vendor: Texas Instruments; Value: 3V3; SMD Solders: 6; Solder Option: RM; TC: 70ppm/C; Tolerance: +-2% Max; Pkg: SOT223-6; Name to order: REG104GA-A; Vref: 1V295; Price: 1000; Device: REG104GA

## Sheet DCDC_int.SchDoc
size 420 x 297 mm; Address1: Address1; Address2: Address2; Address3: Address3; Address4: Address4; SheetNumber: 1; Scale: 1:1; Разраб.: Иванов; Обозначение документа: АБВГ.123456.001 Э3; Пров.: Петров; Утв.: Сидоров; Наименование организации: ОАО "Концерн "МПО-Гидроприбор"; Перв. применение: АБВГ.123456.000; Наименование изделия 1: Плата; Наименование изделия 2: Схема электрическая; Наименование изделия 3: принципиальная; Нач. отд.: Нач. отд.; Фамилия нач. отд.: Сидоров
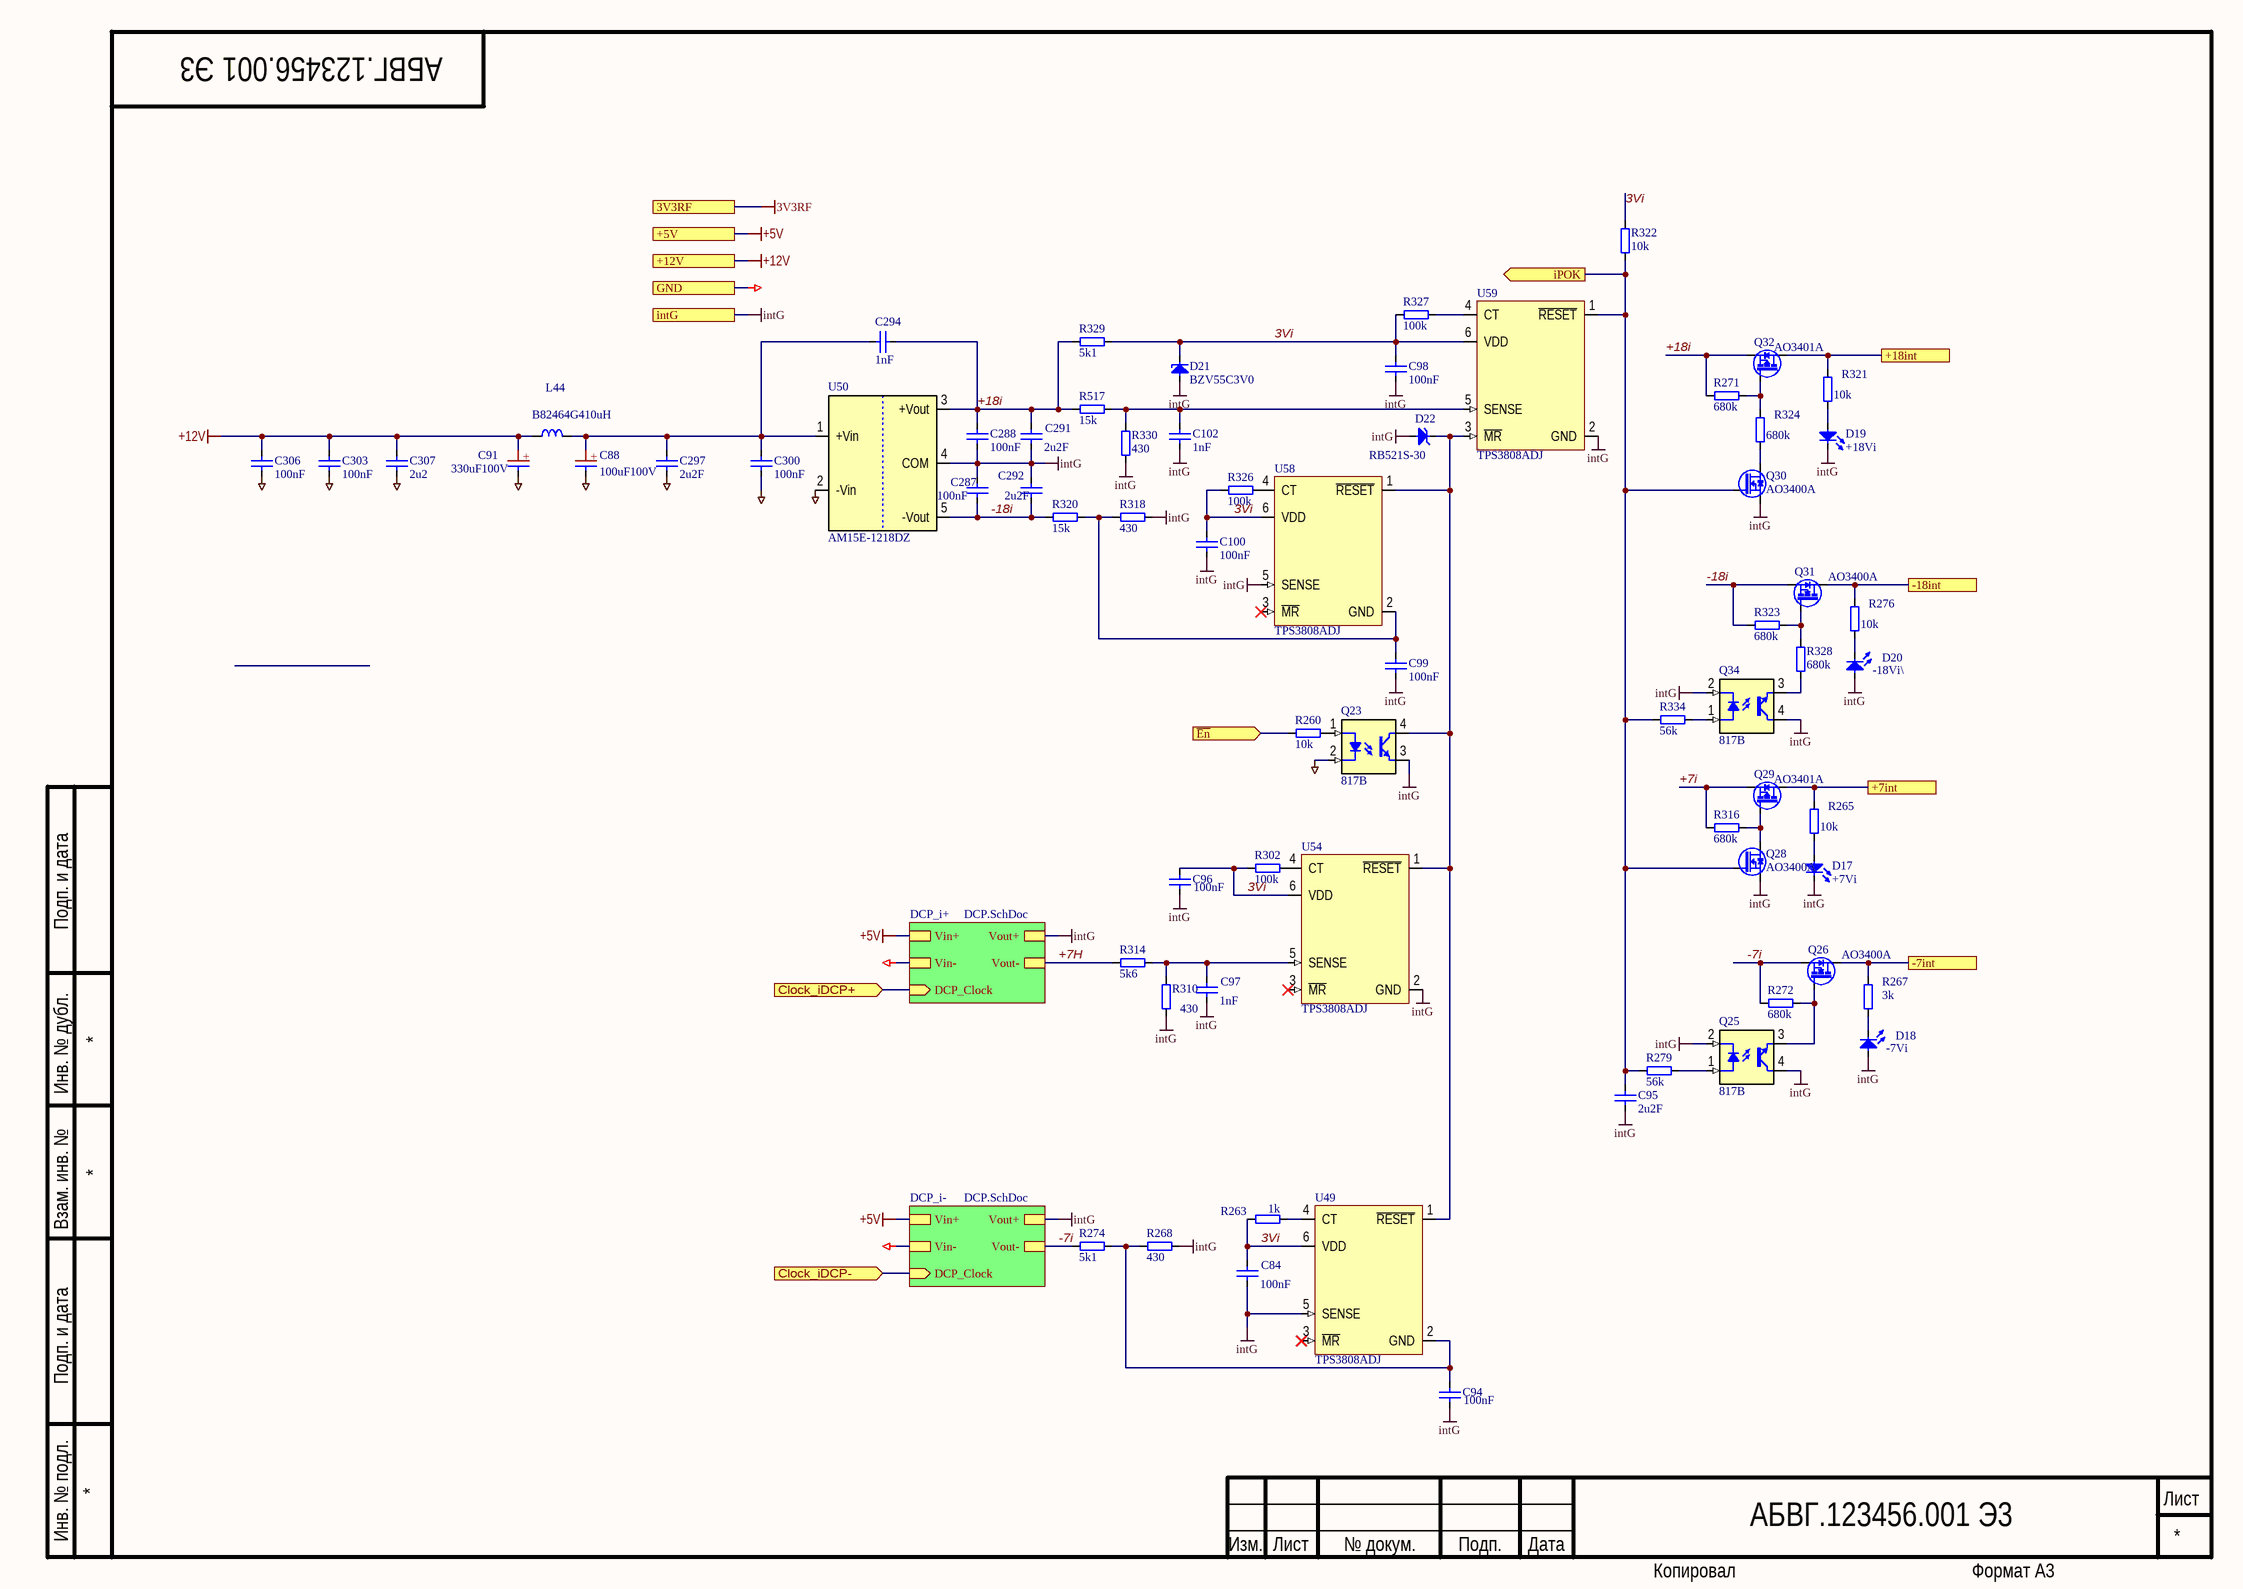
[diagram p20: DCDC_int.SchDoc]

### Parts
(Parts that share a designator on the sheet are numbered #1, #2 ... from top to bottom, then left to right.)
C84  100nF  [SMD0805CAP]
C88#2  100uF100V  [CAPPR500-1000X1250]
C91#2  330uF100V  [CAPPR750-1600X2000]
C94  100nF  [SMD0805CAP]
C95  2u2F  [SMD0805CAP]
C96  100nF  [SMD0805CAP]
C97  1nF  [SMD0805CAP]
C98  100nF  [SMD0805CAP]
C99  100nF  [SMD0805CAP]
C100  100nF  [SMD0805CAP]
C102  1nF  [SMD0805CAP]
C287  100nF  [SMD0805CAP]
C288  100nF  [SMD0805CAP]
C291  2u2F  [SMD0805CAP]
C292  2u2F  [SMD0805CAP]
C294  1nF  [SMD0805CAP]
C297  2u2F  [SMD0805CAP]
C300  100nF  [SMD0805CAP]
C303  100nF  [SMD0805CAP]
C306  100nF  [SMD0805CAP]
C307  2u2  [SMD0805CAP]
D17  +7Vi  [LED0603]
D18  -7Vi  [LED0603]
D19  +18Vi  [LED0603]
D20  -18Vi\  [LED0603]
D21  BZV55C3V0  [DIOMELF3516N]
D22  RB521S-30  [SODFL1608X65N]
L44  B82464G410uH  [IND_COILCRAFT_MSS1038]
Q23  817B  [DIP4-300]
Q25  817B  [DIP4-300]
Q26  AO3400A  [SOT95P229X119-3N]
Q28  AO3400A  [SOT95P229X119-3N]
Q29  AO3401A  [SOT95P229X119-3N]
Q30  AO3400A  [SOT95P229X119-3N]
Q31  AO3400A  [SOT95P229X119-3N]
Q32  AO3401A  [SOT95P229X119-3N]
Q34  817B  [DIP4-300]
R260  10k  [SMD0805RES]
R263  1k  [SMD0805RES]
R265  10k  [SMD0805RES]
R267  3k  [SMD0805RES]
R268  430  [SMD0805RES]
R271  680k  [SMD0805RES]
R272  680k  [SMD0805RES]
R274  5k1  [SMD0805RES]
R276  10k  [SMD0805RES]
R279  56k  [SMD0805RES]
R302  100k  [SMD0805RES]
R310  430  [SMD0805RES]
R314  5k6  [SMD0805RES]
R316  680k  [SMD0805RES]
R318  430  [SMD0805RES]
R320  15k  [SMD0805RES]
R321  10k  [SMD0805RES]
R322  10k  [SMD0805RES]
R323  680k  [SMD0805RES]
R324  680k  [SMD0805RES]
R326  100k  [SMD0805RES]
R327  100k  [SMD0805RES]
R328  680k  [SMD0805RES]
R329  5k1  [SMD0805RES]
R330  430  [SMD0805RES]
R334  56k  [SMD0805RES]
R517  15k  [SMD0805RES]
U49  TPS3808ADJ  [SOT95P270X145-6N]
U50  AM15E-1218DZ  [DCDC_Aimtec_Dual]
U54  TPS3808ADJ  [SOT95P270X145-6N]
U58  TPS3808ADJ  [SOT95P270X145-6N]
U59  TPS3808ADJ  [SOT95P270X145-6N]

### Sub-sheets
DCP_i+ = DCP.SchDoc: DCP_Clock (in), Vout+, Vout-, Vin-, Vin+
DCP_i- = DCP.SchDoc: DCP_Clock (in), Vout+, Vout-, Vin-, Vin+

### Ports
3V3RF, +5V, +7int, +12V, +18int, -7int, -18int, Clock_iDCP+ (in), Clock_iDCP- (in), GND, intG, iPOK (out), ~{En} (in)

### Nets
+5V: port +5V, sheet DCP_i-/Vin+, sheet DCP_i+/Vin+  [project net +5VME]
+12V: C91#2.1(+) C303.2 C306.2 C307.2 L44.1 ; port +12V  [project net +12Vin]
GND: C88#2.2 C91#2.2 C297.1 C300.1 C303.1 C306.1 C307.1 Q23.2(C) U50.2(-Vin) ; port GND, sheet DCP_i-/Vin-, sheet DCP_i+/Vin-  [project net POK_int]
intG: C84.1 C94.1 C95.2 C96.1 C97.1 C98.1 C99.2 C100.2 C102.1 C287.1 C288.2 C291.1 C292.2 D17.1(C) D18.2(A) D19.1(C) D20.2(A) D21.2(A) D22.2(A) Q23.3(E) Q25.2(C) Q25.4(C) Q28.2(S) Q30.2(S) Q34.2(C) Q34.4(C) R268.2 R310.2 R318.2 R330.2 U49.5(SENSE) U50.4(COM) U54.2(GND) U58.5(SENSE) U59.2(GND) ; port intG, sheet DCP_i-/Vout+, sheet DCP_i+/Vout+
3Vi: C84.2 C96.2 C98.2 C100.1 D21.1(C) R263.1 R302.1 R322.1 R326.1 R327.1 R329.1 U49.6(VDD) U54.6(VDD) U58.6(VDD) U59.6(VDD)
+7H: R314.2 ; sheet DCP_i+/Vout-
+7i: Q29.2(S) R316.2
+7int: Q29.3(D) R265.2 ; port +7int
+18i: C288.1 C291.2 C294.2 Q32.2(S) R271.2 R329.2 R517.2 U50.3(+Vout)
+18int: Q32.3(D) R321.2 ; port +18int
-7i: Q26.2(S) R272.2 R274.2 ; sheet DCP_i-/Vout-
-7int: Q26.3(D) R267.2 ; port -7int
-18i: C287.2 C292.1 Q31.2(S) R320.1 R323.2 U50.5(-Vout)
-18int: Q31.3(D) R276.2 ; port -18int
~{En}: R260.1 ; port ~{En}
Clock_iDCP+: port Clock_iDCP+, sheet DCP_i+/DCP_Clock
Clock_iDCP-: port Clock_iDCP-, sheet DCP_i-/DCP_Clock
iPOK: C95.1 Q28.1(G) Q30.1(G) R279.1 R322.2 R334.1 U59.1(~{RESET}) ; port iPOK
NetC88#2_1: C88#2.1(+) C294.1 C297.2 C300.2 L44.2 U50.1(+Vin)
NetC94_2: C94.2 R268.1 R274.1 U49.2(GND)
NetC97_2: C97.2 R310.1 R314.1 U54.5(SENSE)
NetC99_1: C99.1 R318.1 R320.2 U58.2(GND)
NetC102_2: C102.2 R330.1 R517.1 U59.5(SENSE)
NetD17_2: D17.2(A) R265.1
NetD18_1: D18.1(C) R267.1
NetD19_2: D19.2(A) R321.1
NetD20_1: D20.1(C) R276.1
NetD22_1: D22.1(C) Q23.4(C) U49.1(~{RESET}) U54.1(~{RESET}) U58.1(~{RESET}) U59.3(~{MR})
NetQ23_1: Q23.1(A) R260.2
NetQ25_1: Q25.1(A) R279.2
NetQ25_3: Q25.3(E) Q26.1(G) R272.1
NetQ28_3: Q28.3(D) Q29.1(G) R316.1
NetQ30_3: Q30.3(D) R324.1
NetQ31_1: Q31.1(G) R323.1 R328.2
NetQ32_1: Q32.1(G) R271.1 R324.2
NetQ34_1: Q34.1(A) R334.2
NetQ34_3: Q34.3(E) R328.1
NetR263_2: R263.2 U49.4(CT)
NetR302_2: R302.2 U54.4(CT)
NetR326_2: R326.2 U58.4(CT)
NetR327_2: R327.2 U59.4(CT)

Not connected (* = marked no-connect by the designer): U49 3(~{MR})*; U54 3(~{MR})*; U58 3(~{MR})*

### Notes on the sheet
- Подп. и дата
- Инв. № дубл.
- Взам. инв. №
- Инв. № подл.
- Изм.
- Лист
- № докум.
- Подп.
- Дата
- Копировал
- Формат А3

### Library data of the parts
C84 C94-C100 C102 C287 C288 C291 C292 C294 C297 C300 C303 C306 C307 = C0805: as C112#2 on sheet RFCtl; Price: 2
  C84 C94 C96 C98-C100 C287 C288 C300 C303 C306: Value: 100nF
  C95 C291 C292 C297: Value: 2u2F
  C97 C102 C294: Value: 1nF
  C307: Value: 2u2
C88#2 = CAP_POL_5x10: as C68 on sheet DCDC_Hall; Price: 20
C91#2 = CAP_POL_7_5x16: as C66 on sheet DCDC_Hall; Price: 30
D17-D20 = LED0603: as D6 on sheet DCDC_Hall; Price: 10; Device: LED0603
  D17: Value: +7Vi
  D18: Value: -7Vi
  D19: Value: +18Vi
  D20: Value: -18Vi\
D21 = BZV55C: as D5 on sheet Hall; Price: 5; Device: BZV55C; Name to order: BZV55C3V0
D22 = RB521S-30: as D11 on sheet DCDC_Hall; Price: 5; Device: RB521S-30; Name to order: RB521S-30
L44 = B82464G4: as L34 on sheet DCDC_Hall; Price: 400; SMD Solders: 2; Device: B82464G4
Q23 Q25 Q34 = 817B: as Q3 on sheet DCDC_Hall; Device: 817B; Price: 10; Name to order: 817B; Current: 0
Q26 Q28 Q30 Q31 = AO3400A: as Q1 on sheet DCDC_Hall; Price: 10; Device: AO3400A; Name to order: AO3400A
Q29 Q32 = AO3401A: as Q5 on sheet DCDC_Hall; Price: 10; Device: AO3401A; Name to order: AO3401A
R260 R263 R265 R267 R268 R271 R272 R274 R276 R279 R302 R310 R314 R316 R318 R320-R324 R326-R330 R334 R517 = R0805: as R335-R337 on sheet RFCtl; Price: 2
  R260 R265 R276 R321 R322: Value: 10k
  R263: Value: 1k
  R267: Value: 3k
  R268 R310 R318 R330: Value: 430
  R271 R272 R316 R323 R324 R328: Value: 680k
  R274 R329: Value: 5k1
  R279 R334: Value: 56k
  R302 R326 R327: Value: 100k
  R314: Value: 5k6
  R320 R517: Value: 15k
U49 U54 U58 U59 = TPS3808: as U63 on sheet RFCtl; Price: 200; Device: TPS3808
U50 = AM15E-: as U21#2 on sheet DCDC_Hall; Price: 2000; Device: AM15E-